# EAGLE schematic pdp8i (EAGLE 6.6.0), part 2 of 4
## Sheet 10 of 40
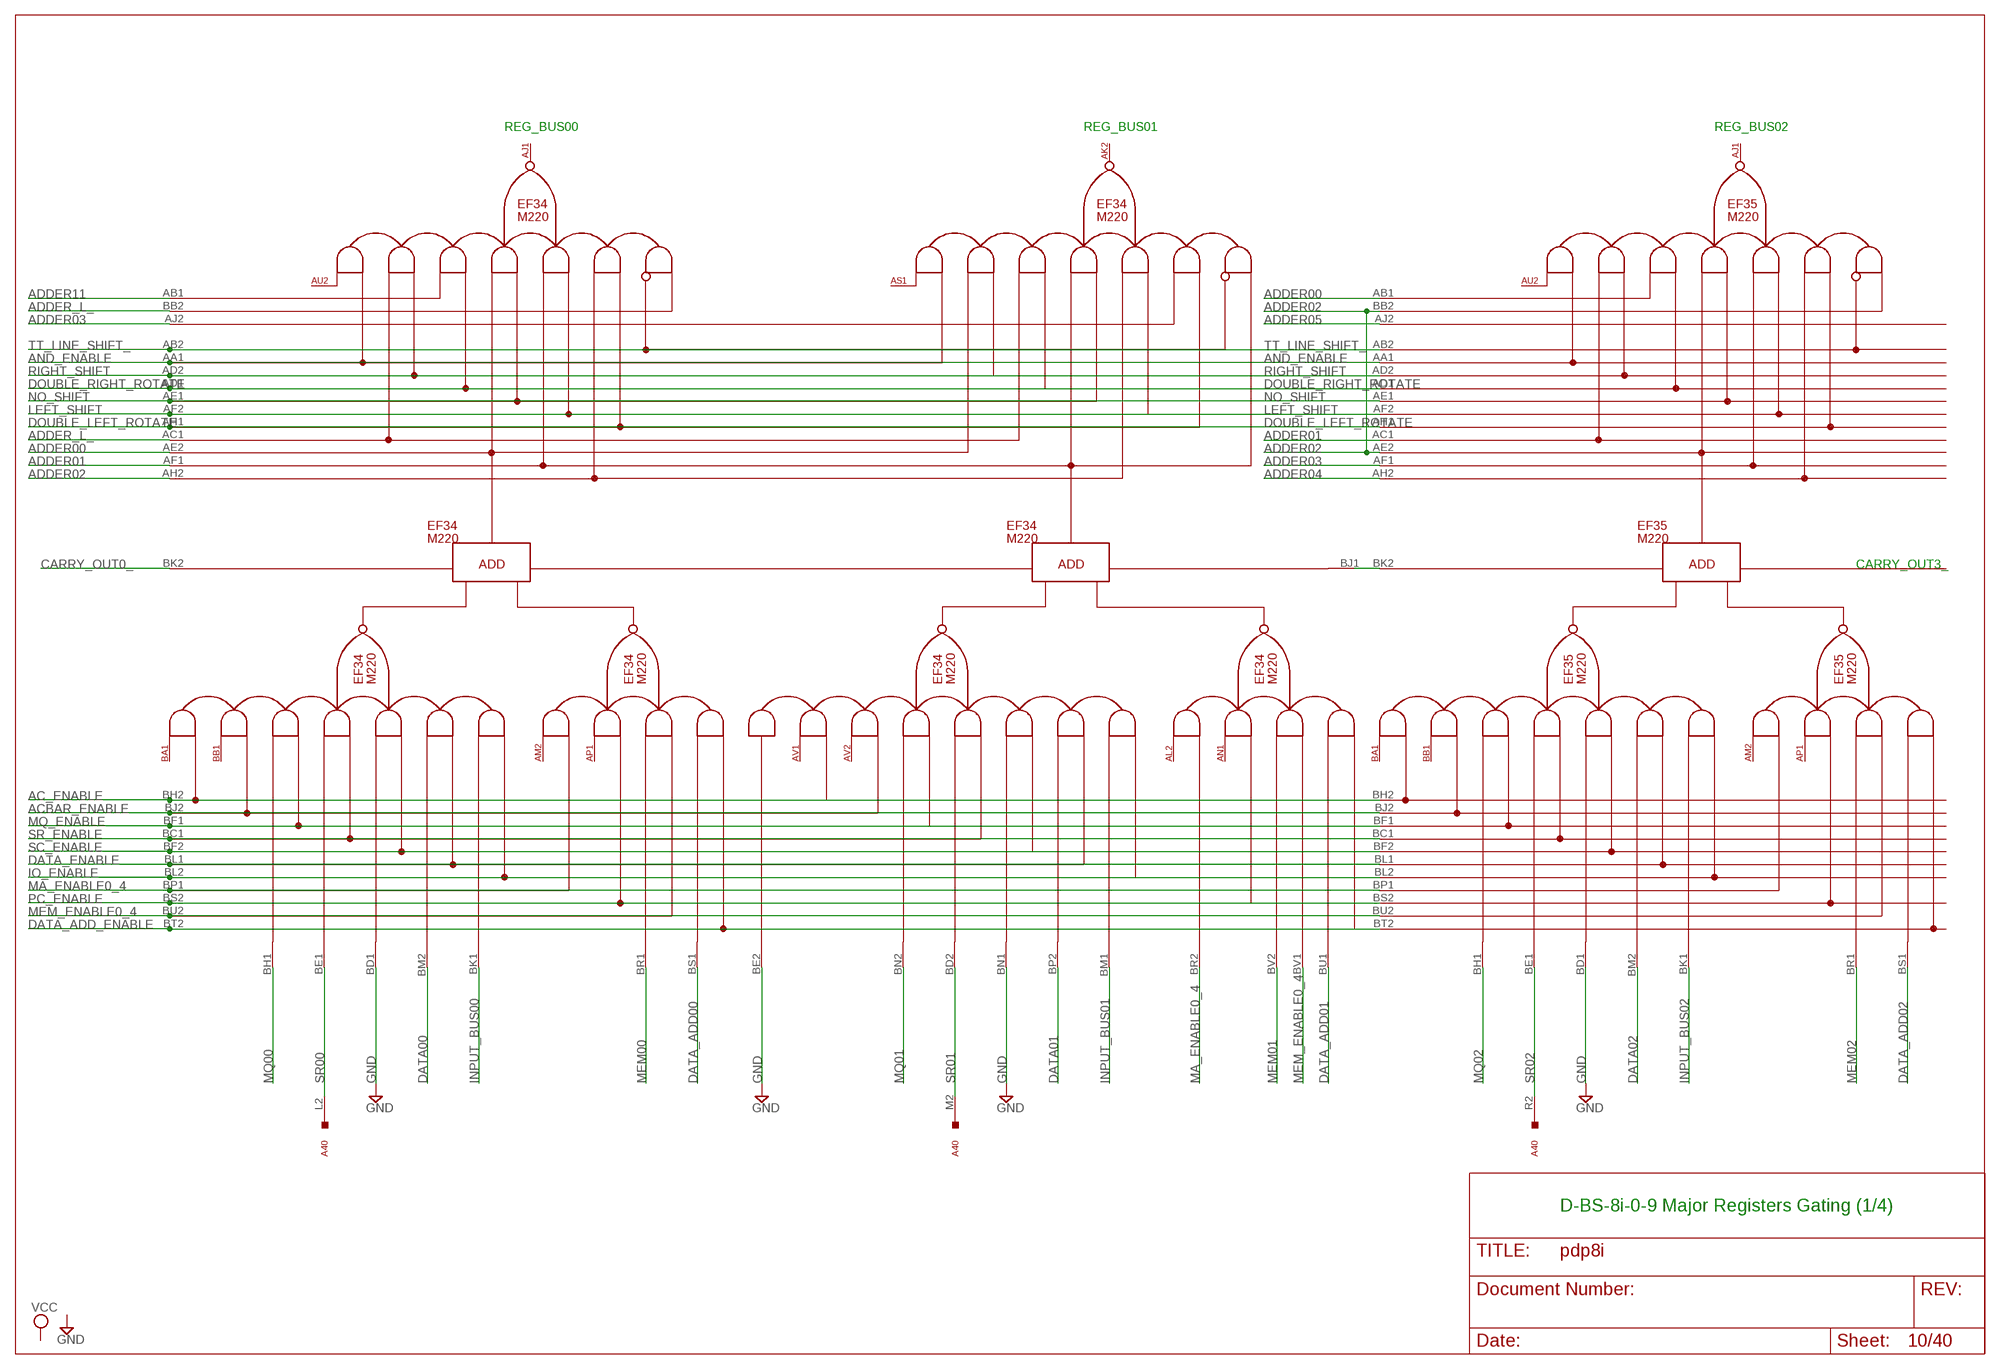
[diagram p9: schematic, sheet 10]

### Parts
A40  W077  M916  [H807]

### Nets
AC_ENABLE: EF34.BH2(B0:BH2) EF35.BH2(B0:BH2) ; also sheet 5,11,12,13
ACBAR_ENABLE: EF34.BJ2(B0:BJ2) EF35.BJ2(B0:BJ2) ; also sheet 5,11,12,13
ADDER00: EF34.AE2(B0:AE2) EF35.AB1(B0:AB1) ; also sheet 9,13
ADDER01: EF34.AF1(B0:AF1) EF35.AC1(B0:AC1) ; also sheet 9
ADDER02: EF34.AH2(B0:AH2) EF35.AE2(B0:AE2) EF35.BB2(B0:BB2) ; also sheet 11
ADDER03: EF34.AJ2(B0:AJ2) EF35.AF1(B0:AF1) ; also sheet 11
ADDER04: EF35.AH2(B0:AH2) ; also sheet 11,12
ADDER05: EF35.AJ2(B0:AJ2) ; also sheet 11,12
ADDER11: EF34.AB1(B0:AB1) ; also sheet 9,12,13
ADDER_L_: EF34.AC1(B0:AC1) EF34.BB2(B0:BB2) ; also sheet 9,13,28
AND_ENABLE: EF34.AA1(B0:AA1) EF35.AA1(B0:AA1) ; also sheet 6,11,12,13
CARRY_OUT0_: EF34.BK2(B0:BK2) ; also sheet 9
DATA00: EF34.BM2(B0:BM2) ; also sheet 14
DATA01: EF34.BP2(B1:BP2) ; also sheet 14
DATA02: EF35.BM2(B0:BM2) ; also sheet 14
DATA_ADD00: EF34.BS1(B0:BS1) ; also sheet 14
DATA_ADD01: EF34.BU1(B1:BU1) ; also sheet 14
DATA_ADD02: EF35.BS1(B0:BS1) ; also sheet 14
DATA_ADD_ENABLE: EF34.BT2(B0:BT2) EF35.BT2(B0:BT2) ; also sheet 5,11,12,13
DATA_ENABLE: EF34.BL1(B0:BL1) EF35.BL1(B0:BL1) ; also sheet 5,11,12,13
DOUBLE_LEFT_ROTATE: EF34.AH1(B0:AH1) EF35.AH1(B0:AH1) ; also sheet 6,9,11,12,13
DOUBLE_RIGHT_ROTATE: EF34.AD1(B0:AD1) EF35.AD1(B0:AD1) ; also sheet 6,9,11,12,13
GND [Suppply]: EF34.BD1(B0:BD1) EF34.BE2(B1:BE2) EF34.BN1(B1:BN1) EF35.BD1(B0:BD1) ; also sheet 2,5,9,11,12,13,14,15,17,18,23,26,27,30,33,34,35,39
INPUT_BUS00: EF34.BK1(B0:BK1) ; also sheet 14
INPUT_BUS01: EF34.BM1(B1:BM1) ; also sheet 14
INPUT_BUS02: EF35.BK1(B0:BK1) ; also sheet 14
IO_ENABLE: EF34.BL2(B0:BL2) EF35.BL2(B0:BL2) ; also sheet 5,7,11,12,13
LEFT_SHIFT: EF34.AF2(B0:AF2) EF35.AF2(B0:AF2) ; also sheet 6,9,11,12,13
MA_ENABLE0_4: EF34.BP1(B0:BP1) EF34.BR2(B1:BR2) EF35.BP1(B0:BP1) ; also sheet 5,11
MEM00: EF34.BR1(B0:BR1) ; also sheet 4,18,29,31
MEM01: EF34.BV2(B1:BV2) ; also sheet 4,18,31
MEM02: EF35.BR1(B0:BR1) ; also sheet 4,18,31
MEM_ENABLE0_4: EF34.BU2(B0:BU2) EF34.BV1(B1:BV1) EF35.BU2(B0:BU2) ; also sheet 5,6,11
MQ00: EF34.BH1(B0:BH1) ; also sheet 27,28
MQ01: EF34.BN2(B1:BN2) ; also sheet 28
MQ02: EF35.BH1(B0:BH1) ; also sheet 28
MQ_ENABLE: EF34.BF1(B0:BF1) EF35.BF1(B0:BF1) ; also sheet 11,12,13,27
N$160: EF34.BJ1(B1:BJ1) EF35.BK2(B0:BK2)
NO_SHIFT: EF34.AE1(B0:AE1) EF35.AE1(B0:AE1) ; also sheet 6,9,11,12,13
PC_ENABLE: EF34.BS2(B0:BS2) EF35.BS2(B0:BS2) ; also sheet 5,11,12,13
RIGHT_SHIFT: EF34.AD2(B0:AD2) EF35.AD2(B0:AD2) ; also sheet 6,9,11,12,13,28
SC_ENABLE: EF34.BF2(B0:BF2) EF35.BF2(B0:BF2) ; also sheet 11,12,13,27
SR00: A40.L2 EF34.BE1(B0:BE1)
SR01: A40.M2 EF34.BD2(B1:BD2)
SR02: A40.R2 EF35.BE1(B0:BE1)
SR_ENABLE: EF34.BC1(B0:BC1) EF35.BC1(B0:BC1) ; also sheet 5,11,12,13,22
TT_LINE_SHIFT_: EF34.AB2(B0:AB2) EF35.AB2(B0:AB2) ; also sheet 11,12,13,29
Unconnected: A40.A1 A40.B1 A40.B2 A40.C1 A40.D1 A40.E1 A40.F1 A40.H1 A40.J1 A40.K1 A40.L1 A40.M1 A40.N1 A40.N2 A40.P1 A40.P2 A40.R1 A40.S1 A40.T1 A40.U1 A40.V1

### Notes on the sheet
- REG_BUS00 | REG_BUS01 | REG_BUS02
- CARRY_OUT3_
- D-BS-8i-0-9 Major Registers Gating (1/4)

## Sheet 11 of 40
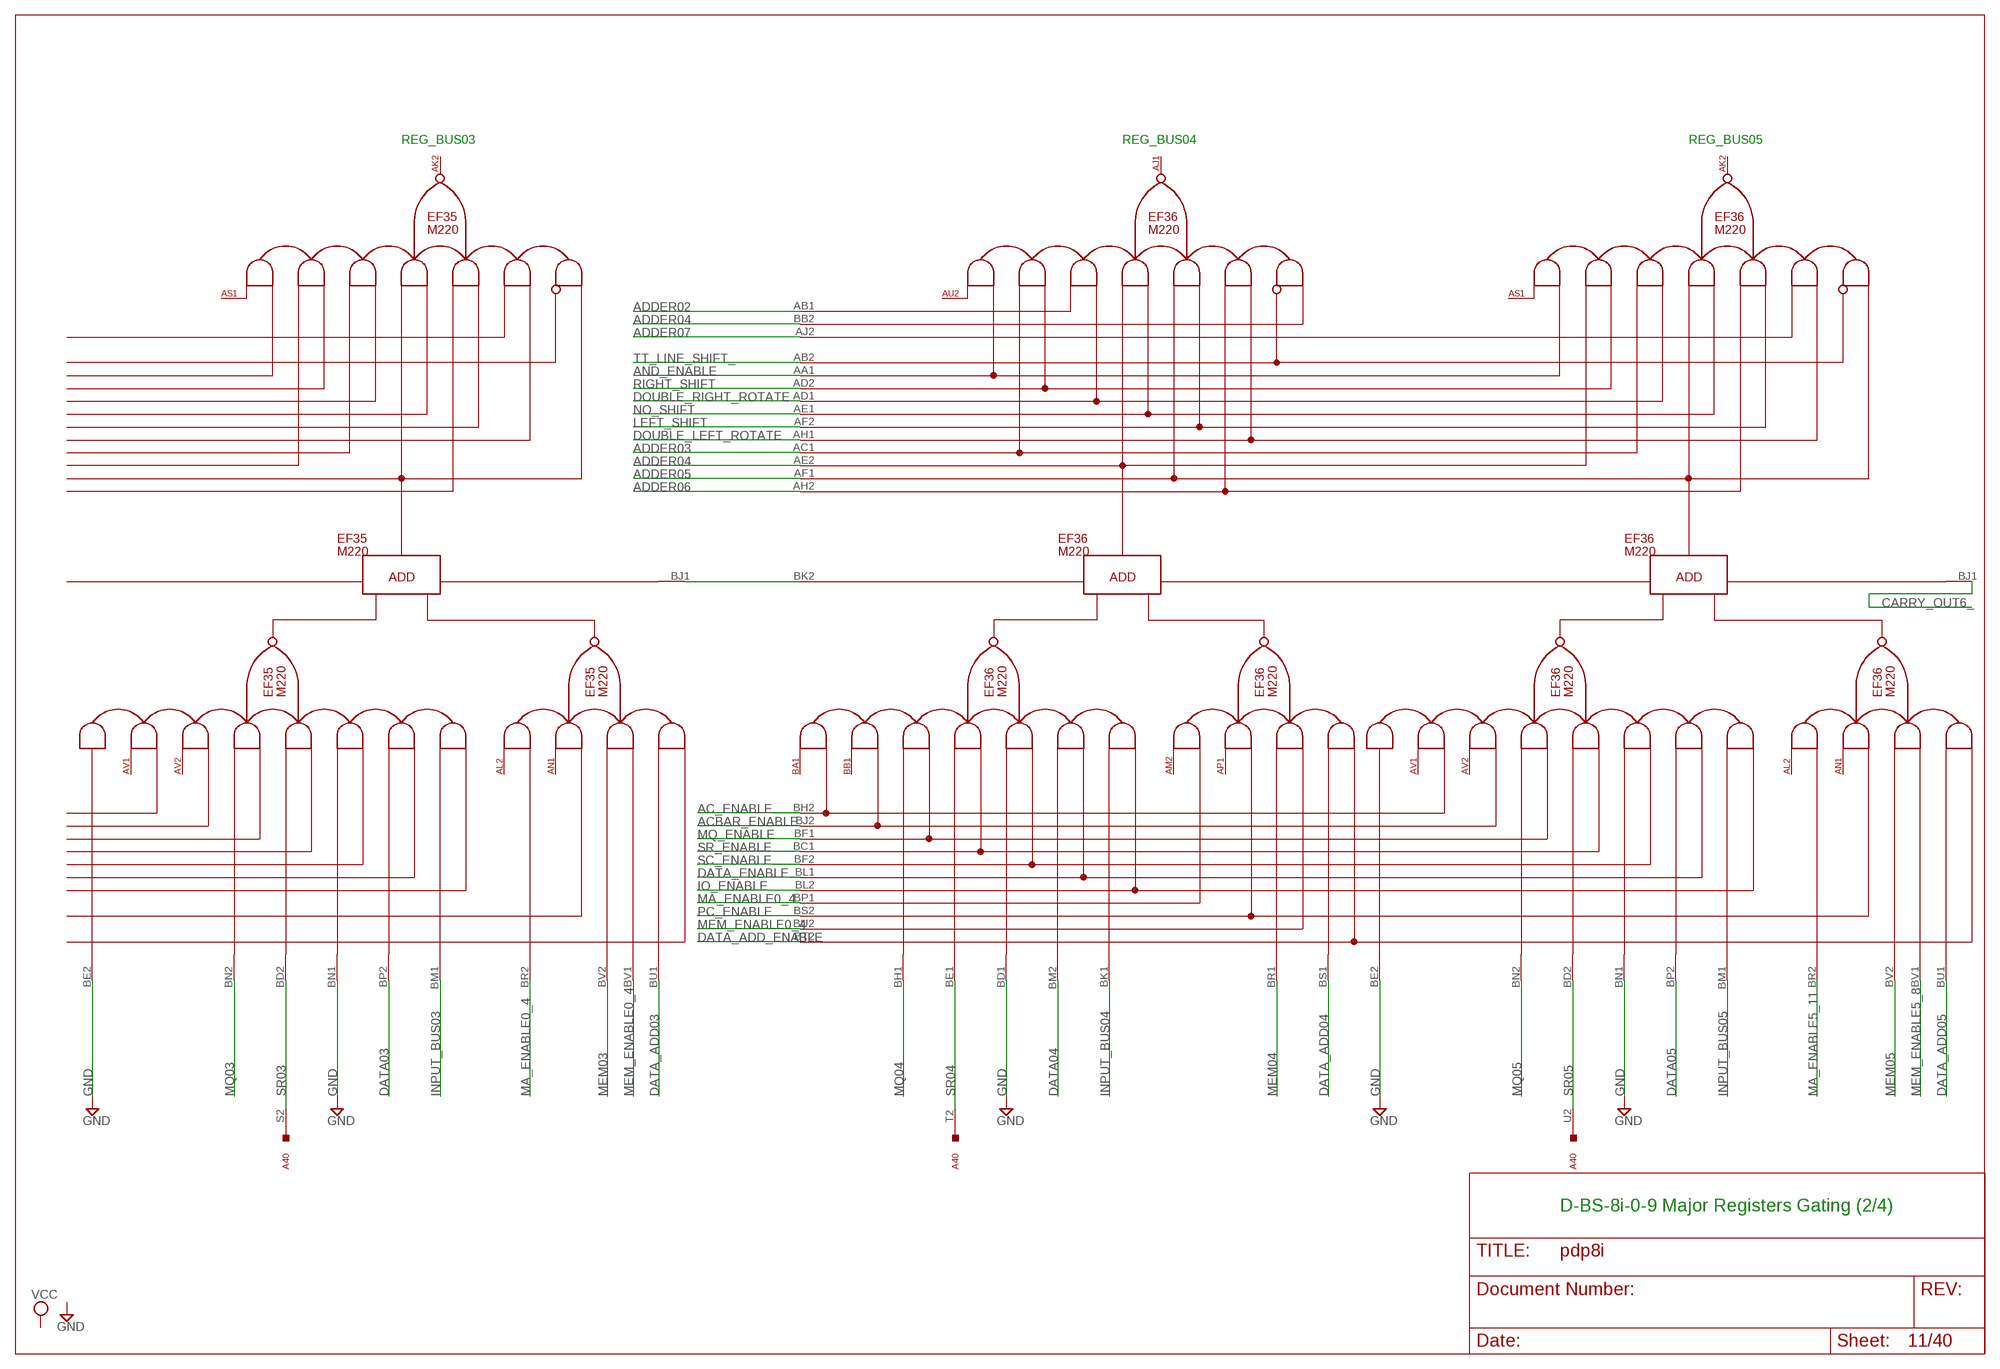
[diagram p10: schematic, sheet 11]

### Nets
AC_ENABLE: EF36.BH2(B0:BH2) ; also sheet 5,10,12,13
ACBAR_ENABLE: EF36.BJ2(B0:BJ2) ; also sheet 5,10,12,13
ADDER02: EF36.AB1(B0:AB1) ; also sheet 10
ADDER03: EF36.AC1(B0:AC1) ; also sheet 10
ADDER04: EF36.AE2(B0:AE2) EF36.BB2(B0:BB2) ; also sheet 10,12
ADDER05: EF36.AF1(B0:AF1) ; also sheet 10,12
ADDER06: EF36.AH2(B0:AH2) ; also sheet 12
ADDER07: EF36.AJ2(B0:AJ2) ; also sheet 12
AND_ENABLE: EF36.AA1(B0:AA1) ; also sheet 6,10,12,13
CARRY_OUT6_: EF36.BJ1(B1:BJ1) ; also sheet 12
DATA03: EF35.BP2(B1:BP2) ; also sheet 14
DATA04: EF36.BM2(B0:BM2) ; also sheet 14
DATA05: EF36.BP2(B1:BP2) ; also sheet 14
DATA_ADD03: EF35.BU1(B1:BU1) ; also sheet 14
DATA_ADD04: EF36.BS1(B0:BS1) ; also sheet 14
DATA_ADD05: EF36.BU1(B1:BU1) ; also sheet 14
DATA_ADD_ENABLE: EF36.BT2(B0:BT2) ; also sheet 5,10,12,13
DATA_ENABLE: EF36.BL1(B0:BL1) ; also sheet 5,10,12,13
DOUBLE_LEFT_ROTATE: EF36.AH1(B0:AH1) ; also sheet 6,9,10,12,13
DOUBLE_RIGHT_ROTATE: EF36.AD1(B0:AD1) ; also sheet 6,9,10,12,13
GND [Suppply]: EF35.BE2(B1:BE2) EF35.BN1(B1:BN1) EF36.BD1(B0:BD1) EF36.BE2(B1:BE2) EF36.BN1(B1:BN1) ; also sheet 2,5,9,10,12,13,14,15,17,18,23,26,27,30,33,34,35,39
INPUT_BUS03: EF35.BM1(B1:BM1) ; also sheet 14
INPUT_BUS04: EF36.BK1(B0:BK1) ; also sheet 14
INPUT_BUS05: EF36.BM1(B1:BM1) ; also sheet 14
IO_ENABLE: EF36.BL2(B0:BL2) ; also sheet 5,7,10,12,13
LEFT_SHIFT: EF36.AF2(B0:AF2) ; also sheet 6,9,10,12,13
MA_ENABLE0_4: EF35.BR2(B1:BR2) EF36.BP1(B0:BP1) ; also sheet 5,10
MA_ENABLE5_11: EF36.BR2(B1:BR2) ; also sheet 5,12,13
MEM03: EF35.BV2(B1:BV2) ; also sheet 18,31
MEM04: EF36.BR1(B0:BR1) ; also sheet 18,31
MEM05: EF36.BV2(B1:BV2) ; also sheet 18,31
MEM_ENABLE0_4: EF35.BV1(B1:BV1) EF36.BU2(B0:BU2) ; also sheet 5,6,10
MEM_ENABLE5_8: EF36.BV1(B1:BV1) ; also sheet 5,12
MQ03: EF35.BN2(B1:BN2) ; also sheet 28
MQ04: EF36.BH1(B0:BH1) ; also sheet 28
MQ05: EF36.BN2(B1:BN2) ; also sheet 28
MQ_ENABLE: EF36.BF1(B0:BF1) ; also sheet 10,12,13,27
N$133: EF35.BJ1(B1:BJ1) EF36.BK2(B0:BK2)
NO_SHIFT: EF36.AE1(B0:AE1) ; also sheet 6,9,10,12,13
PC_ENABLE: EF36.BS2(B0:BS2) ; also sheet 5,10,12,13
RIGHT_SHIFT: EF36.AD2(B0:AD2) ; also sheet 6,9,10,12,13,28
SC_ENABLE: EF36.BF2(B0:BF2) ; also sheet 10,12,13,27
SR03: A40.S2 EF35.BD2(B1:BD2)
SR04: A40.T2 EF36.BE1(B0:BE1)
SR05: A40.U2 EF36.BD2(B1:BD2)
SR_ENABLE: EF36.BC1(B0:BC1) ; also sheet 5,10,12,13,22
TT_LINE_SHIFT_: EF36.AB2(B0:AB2) ; also sheet 10,12,13,29

### Notes on the sheet
- REG_BUS03 | REG_BUS04 | REG_BUS05
- D-BS-8i-0-9 Major Registers Gating (2/4)

## Sheet 12 of 40
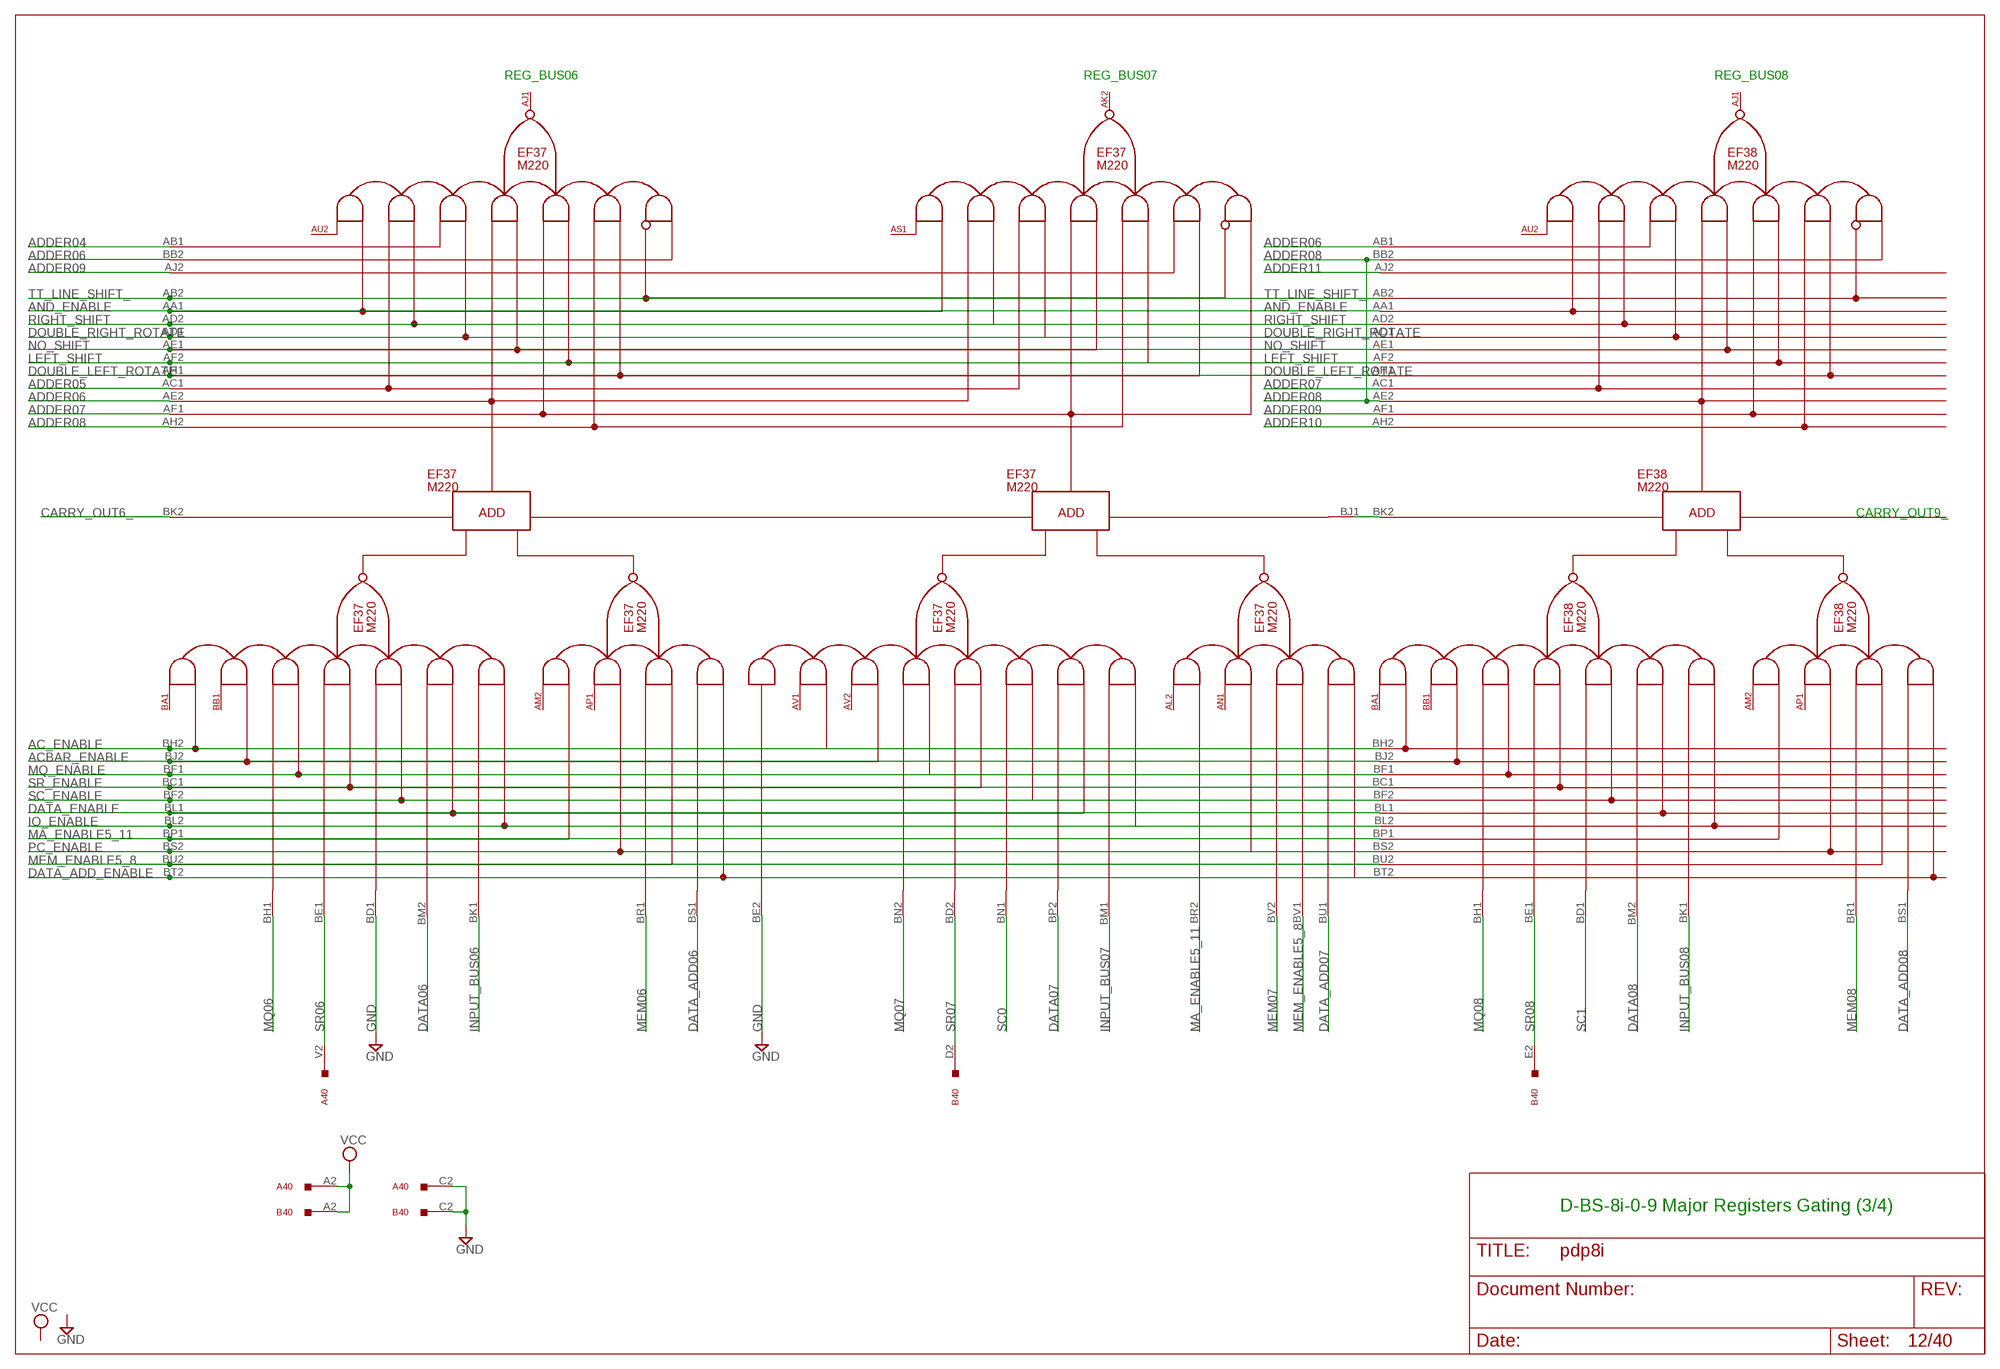
[diagram p11: schematic, sheet 12]

### Nets
AC_ENABLE: EF37.BH2(B0:BH2) EF38.BH2(B0:BH2) ; also sheet 5,10,11,13
ACBAR_ENABLE: EF37.BJ2(B0:BJ2) EF38.BJ2(B0:BJ2) ; also sheet 5,10,11,13
ADDER04: EF37.AB1(B0:AB1) ; also sheet 10,11
ADDER05: EF37.AC1(B0:AC1) ; also sheet 10,11
ADDER06: EF37.AE2(B0:AE2) EF37.BB2(B0:BB2) EF38.AB1(B0:AB1) ; also sheet 11
ADDER07: EF37.AF1(B0:AF1) EF38.AC1(B0:AC1) ; also sheet 11
ADDER08: EF37.AH2(B0:AH2) EF38.AE2(B0:AE2) EF38.BB2(B0:BB2) ; also sheet 13
ADDER09: EF37.AJ2(B0:AJ2) EF38.AF1(B0:AF1) ; also sheet 13
ADDER10: EF38.AH2(B0:AH2) ; also sheet 9,13
ADDER11: EF38.AJ2(B0:AJ2) ; also sheet 9,10,13
AND_ENABLE: EF37.AA1(B0:AA1) EF38.AA1(B0:AA1) ; also sheet 6,10,11,13
CARRY_OUT6_: EF37.BK2(B0:BK2) ; also sheet 11
DATA06: EF37.BM2(B0:BM2) ; also sheet 14
DATA07: EF37.BP2(B1:BP2) ; also sheet 14
DATA08: EF38.BM2(B0:BM2) ; also sheet 14
DATA_ADD06: EF37.BS1(B0:BS1) ; also sheet 14
DATA_ADD07: EF37.BU1(B1:BU1) ; also sheet 14
DATA_ADD08: EF38.BS1(B0:BS1) ; also sheet 14
DATA_ADD_ENABLE: EF37.BT2(B0:BT2) EF38.BT2(B0:BT2) ; also sheet 5,10,11,13
DATA_ENABLE: EF37.BL1(B0:BL1) EF38.BL1(B0:BL1) ; also sheet 5,10,11,13
DOUBLE_LEFT_ROTATE: EF37.AH1(B0:AH1) EF38.AH1(B0:AH1) ; also sheet 6,9,10,11,13
DOUBLE_RIGHT_ROTATE: EF37.AD1(B0:AD1) EF38.AD1(B0:AD1) ; also sheet 6,9,10,11,13
GND [Suppply]: A40.C2 B40.C2 EF37.BD1(B0:BD1) EF37.BE2(B1:BE2) ; also sheet 2,5,9,10,11,13,14,15,17,18,23,26,27,30,33,34,35,39
INPUT_BUS06: EF37.BK1(B0:BK1) ; also sheet 14
INPUT_BUS07: EF37.BM1(B1:BM1) ; also sheet 14
INPUT_BUS08: EF38.BK1(B0:BK1) ; also sheet 14
IO_ENABLE: EF37.BL2(B0:BL2) EF38.BL2(B0:BL2) ; also sheet 5,7,10,11,13
LEFT_SHIFT: EF37.AF2(B0:AF2) EF38.AF2(B0:AF2) ; also sheet 6,9,10,11,13
MA_ENABLE5_11: EF37.BP1(B0:BP1) EF37.BR2(B1:BR2) EF38.BP1(B0:BP1) ; also sheet 5,11,13
MEM06: EF37.BR1(B0:BR1) ; also sheet 18,31
MEM07: EF37.BV2(B1:BV2) ; also sheet 18,31
MEM08: EF38.BR1(B0:BR1) ; also sheet 18,31
MEM_ENABLE5_8: EF37.BU2(B0:BU2) EF37.BV1(B1:BV1) EF38.BU2(B0:BU2) ; also sheet 5,11
MQ06: EF37.BH1(B0:BH1) ; also sheet 28
MQ07: EF37.BN2(B1:BN2) ; also sheet 28
MQ08: EF38.BH1(B0:BH1) ; also sheet 28
MQ_ENABLE: EF37.BF1(B0:BF1) EF38.BF1(B0:BF1) ; also sheet 10,11,13,27
N$132: EF37.BJ1(B1:BJ1) EF38.BK2(B0:BK2)
NO_SHIFT: EF37.AE1(B0:AE1) EF38.AE1(B0:AE1) ; also sheet 6,9,10,11,13
PC_ENABLE: EF37.BS2(B0:BS2) EF38.BS2(B0:BS2) ; also sheet 5,10,11,13
RIGHT_SHIFT: EF37.AD2(B0:AD2) EF38.AD2(B0:AD2) ; also sheet 6,9,10,11,13,28
SC0: EF37.BN1(B1:BN1) ; also sheet 27,28
SC1: EF38.BD1(B0:BD1) ; also sheet 27,28
SC_ENABLE: EF37.BF2(B0:BF2) EF38.BF2(B0:BF2) ; also sheet 10,11,13,27
SR06: A40.V2 EF37.BE1(B0:BE1)
SR07: B40.D2 EF37.BD2(B1:BD2)
SR08: B40.E2 EF38.BE1(B0:BE1)
SR_ENABLE: EF37.BC1(B0:BC1) EF38.BC1(B0:BC1) ; also sheet 5,10,11,13,22
TT_LINE_SHIFT_: EF37.AB2(B0:AB2) EF38.AB2(B0:AB2) ; also sheet 10,11,13,29
VCC [Suppply]: A40.A2 B40.A2 ; also sheet 9,33

### Notes on the sheet
- REG_BUS06 | REG_BUS07 | REG_BUS08
- CARRY_OUT9_
- D-BS-8i-0-9 Major Registers Gating (3/4)

## Sheet 13 of 40
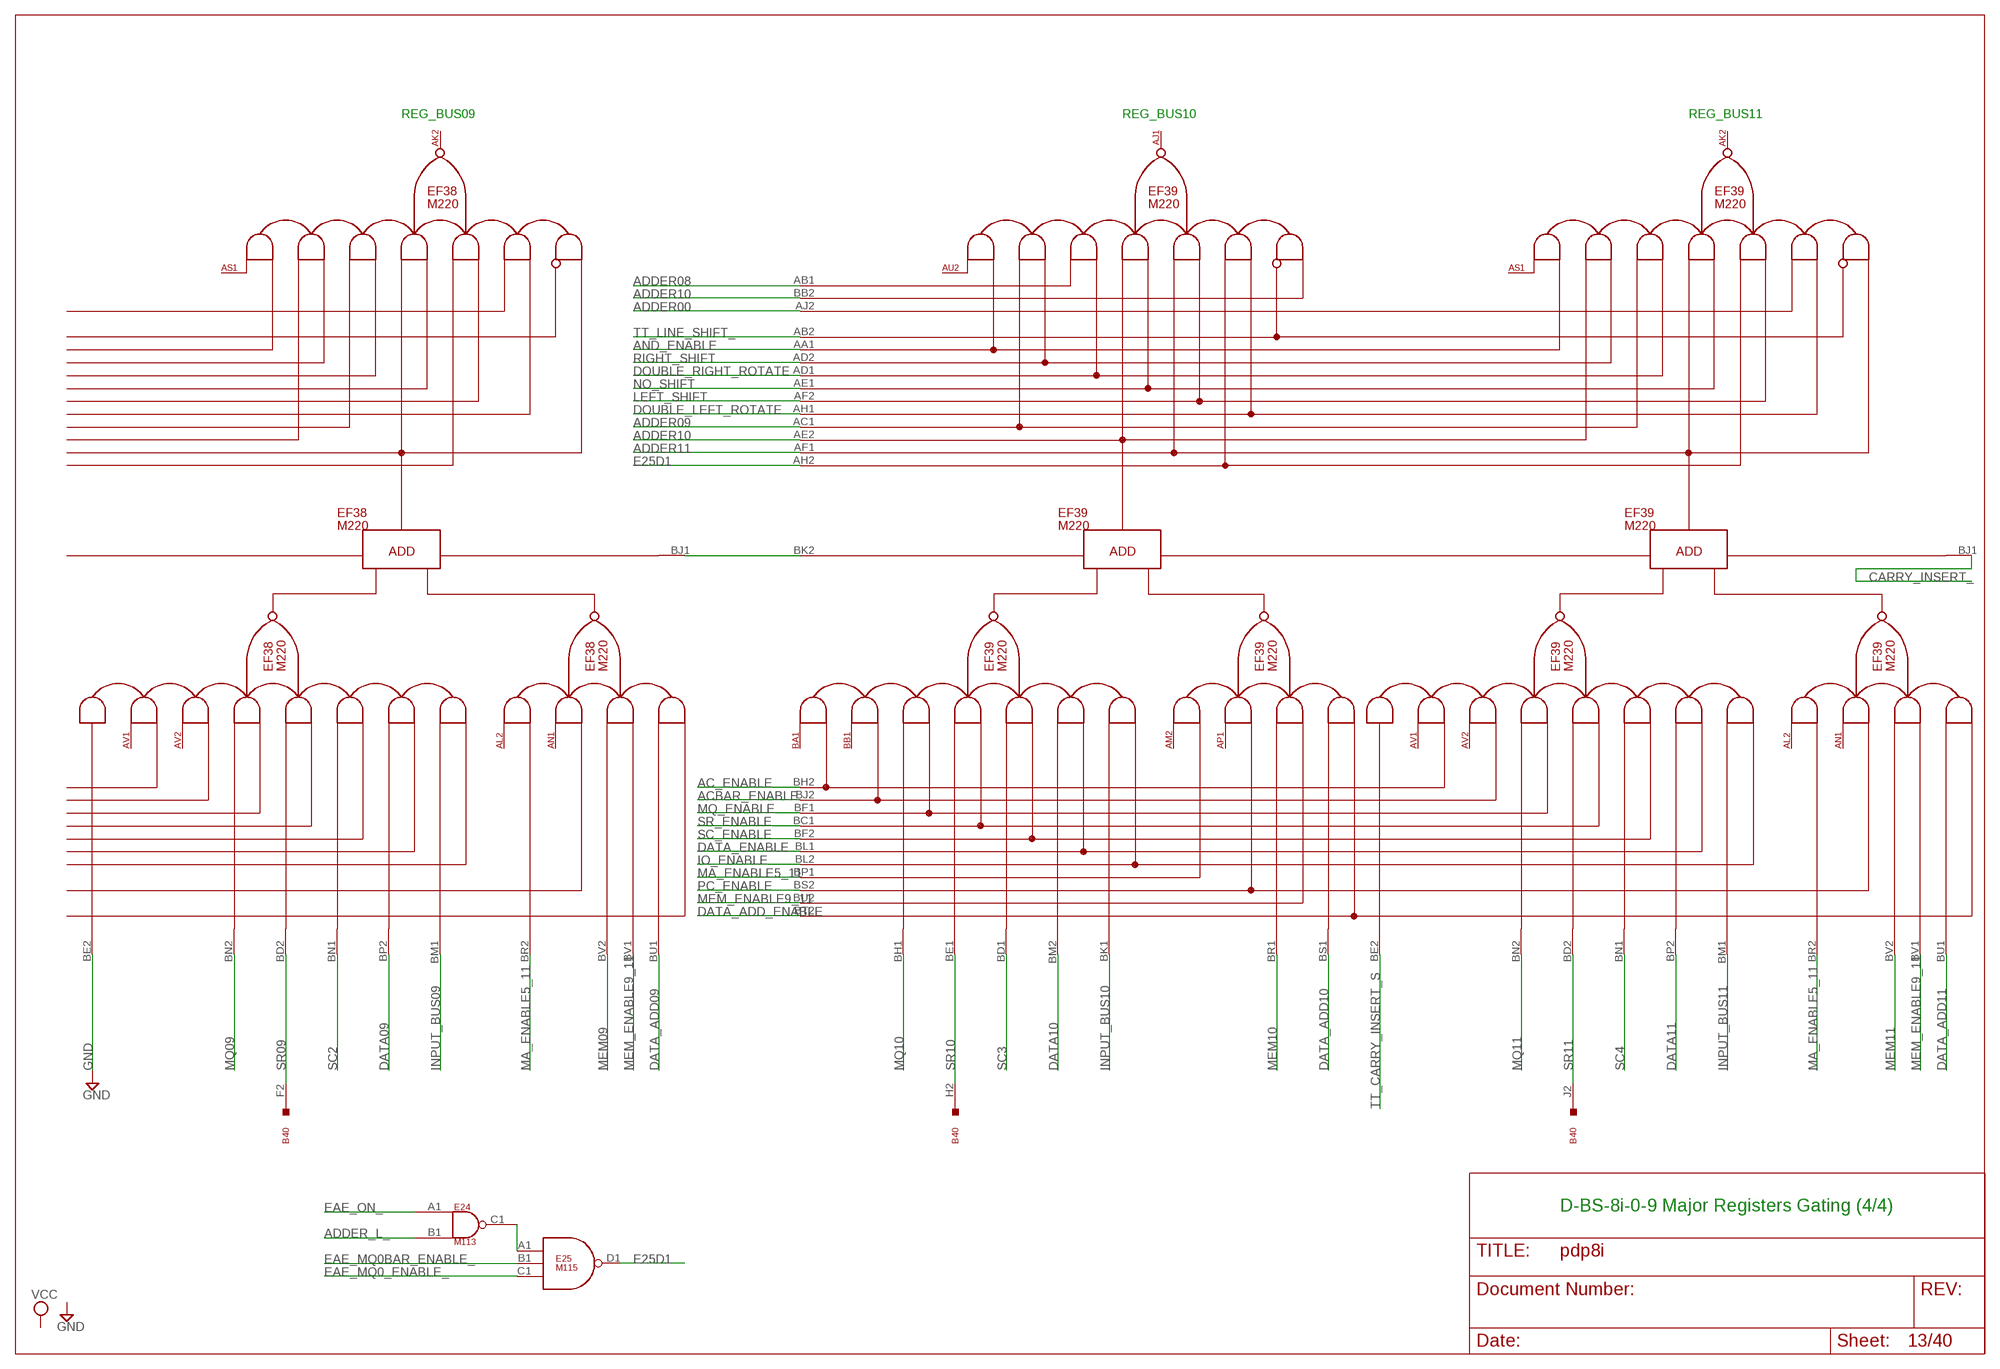
[diagram p12: schematic, sheet 13]

### Nets
AC_ENABLE: EF39.BH2(B0:BH2) ; also sheet 5,10,11,12
ACBAR_ENABLE: EF39.BJ2(B0:BJ2) ; also sheet 5,10,11,12
ADDER00: EF39.AJ2(B0:AJ2) ; also sheet 9,10
ADDER08: EF39.AB1(B0:AB1) ; also sheet 12
ADDER09: EF39.AC1(B0:AC1) ; also sheet 12
ADDER10: EF39.AE2(B0:AE2) EF39.BB2(B0:BB2) ; also sheet 9,12
ADDER11: EF39.AF1(B0:AF1) ; also sheet 9,10,12
ADDER_L_: E24.B1(C1:IN2) ; also sheet 9,10,28
AND_ENABLE: EF39.AA1(B0:AA1) ; also sheet 6,10,11,12
CARRY_INSERT_: EF39.BJ1(B1:BJ1) ; also sheet 6
DATA09: EF38.BP2(B1:BP2) ; also sheet 14
DATA10: EF39.BM2(B0:BM2) ; also sheet 14
DATA11: EF39.BP2(B1:BP2) ; also sheet 14
DATA_ADD09: EF38.BU1(B1:BU1) ; also sheet 14
DATA_ADD10: EF39.BS1(B0:BS1) ; also sheet 14
DATA_ADD11: EF39.BU1(B1:BU1) ; also sheet 14
DATA_ADD_ENABLE: EF39.BT2(B0:BT2) ; also sheet 5,10,11,12
DATA_ENABLE: EF39.BL1(B0:BL1) ; also sheet 5,10,11,12
DOUBLE_LEFT_ROTATE: EF39.AH1(B0:AH1) ; also sheet 6,9,10,11,12
DOUBLE_RIGHT_ROTATE: EF39.AD1(B0:AD1) ; also sheet 6,9,10,11,12
E25D1: E25.D1(D1:OUT) EF39.AH2(B0:AH2)
EAE_MQ0_ENABLE_: E25.C1(D1:IN3) ; also sheet 27
EAE_MQ0BAR_ENABLE_: E25.B1(D1:IN2) ; also sheet 27
EAE_ON_: E24.A1(C1:IN1) ; also sheet 9,27
GND [Suppply]: EF38.BE2(B1:BE2) ; also sheet 2,5,9,10,11,12,14,15,17,18,23,26,27,30,33,34,35,39
INPUT_BUS09: EF38.BM1(B1:BM1) ; also sheet 14
INPUT_BUS10: EF39.BK1(B0:BK1) ; also sheet 14
INPUT_BUS11: EF39.BM1(B1:BM1) ; also sheet 14
IO_ENABLE: EF39.BL2(B0:BL2) ; also sheet 5,7,10,11,12
LEFT_SHIFT: EF39.AF2(B0:AF2) ; also sheet 6,9,10,11,12
MA_ENABLE5_11: EF38.BR2(B1:BR2) EF39.BP1(B0:BP1) EF39.BR2(B1:BR2) ; also sheet 5,11,12
MEM09: EF38.BV2(B1:BV2) ; also sheet 18,29,31
MEM10: EF39.BR1(B0:BR1) ; also sheet 18,31
MEM11: EF39.BV2(B1:BV2) ; also sheet 18,31
MEM_ENABLE9_11: EF38.BV1(B1:BV1) EF39.BU2(B0:BU2) EF39.BV1(B1:BV1) ; also sheet 5
MQ09: EF38.BN2(B1:BN2) ; also sheet 28
MQ10: EF39.BH1(B0:BH1) ; also sheet 27,28
MQ11: EF39.BN2(B1:BN2) ; also sheet 27,28
MQ_ENABLE: EF39.BF1(B0:BF1) ; also sheet 10,11,12,27
N$136: EF38.BJ1(B1:BJ1) EF39.BK2(B0:BK2)
N$140: E24.C1(C1:OUT) E25.A1(D1:IN1)
NO_SHIFT: EF39.AE1(B0:AE1) ; also sheet 6,9,10,11,12
PC_ENABLE: EF39.BS2(B0:BS2) ; also sheet 5,10,11,12
RIGHT_SHIFT: EF39.AD2(B0:AD2) ; also sheet 6,9,10,11,12,28
SC2: EF38.BN1(B1:BN1) ; also sheet 27,28
SC3: EF39.BD1(B0:BD1) ; also sheet 27,28
SC4: EF39.BN1(B1:BN1) ; also sheet 27,28
SC_ENABLE: EF39.BF2(B0:BF2) ; also sheet 10,11,12,27
SR09: B40.F2 EF38.BD2(B1:BD2)
SR10: B40.H2 EF39.BE1(B0:BE1)
SR11: B40.J2 EF39.BD2(B1:BD2)
SR_ENABLE: EF39.BC1(B0:BC1) ; also sheet 5,10,11,12,22
TT_CARRY_INSERT_S: EF39.BE2(B1:BE2) ; also sheet 29
TT_LINE_SHIFT_: EF39.AB2(B0:AB2) ; also sheet 10,11,12,29

### Notes on the sheet
- REG_BUS09 | REG_BUS10 | REG_BUS11
- D-BS-8i-0-9 Major Registers Gating (4/4)

## Sheet 14 of 40
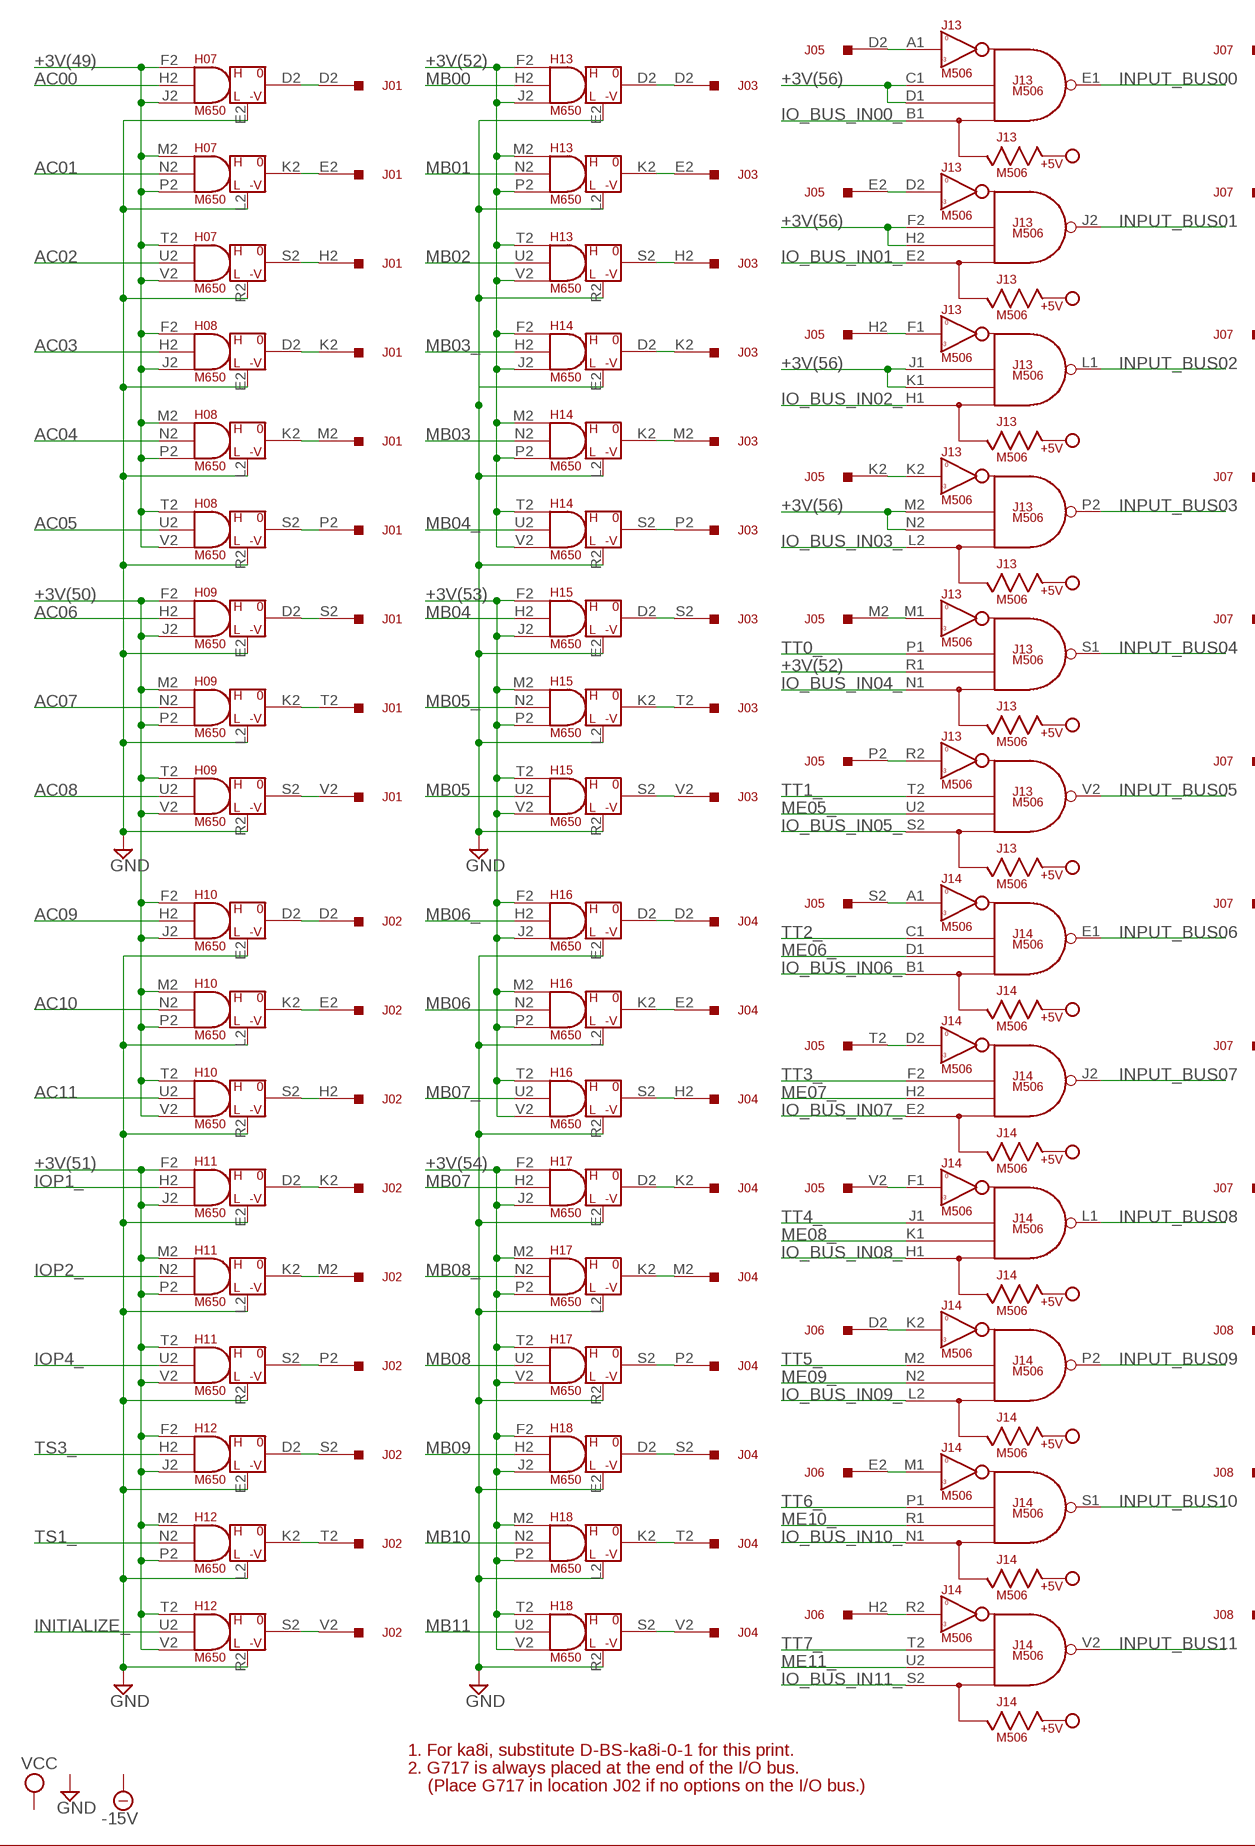
[diagram p13: schematic, sheet 14, part 1 of 2]
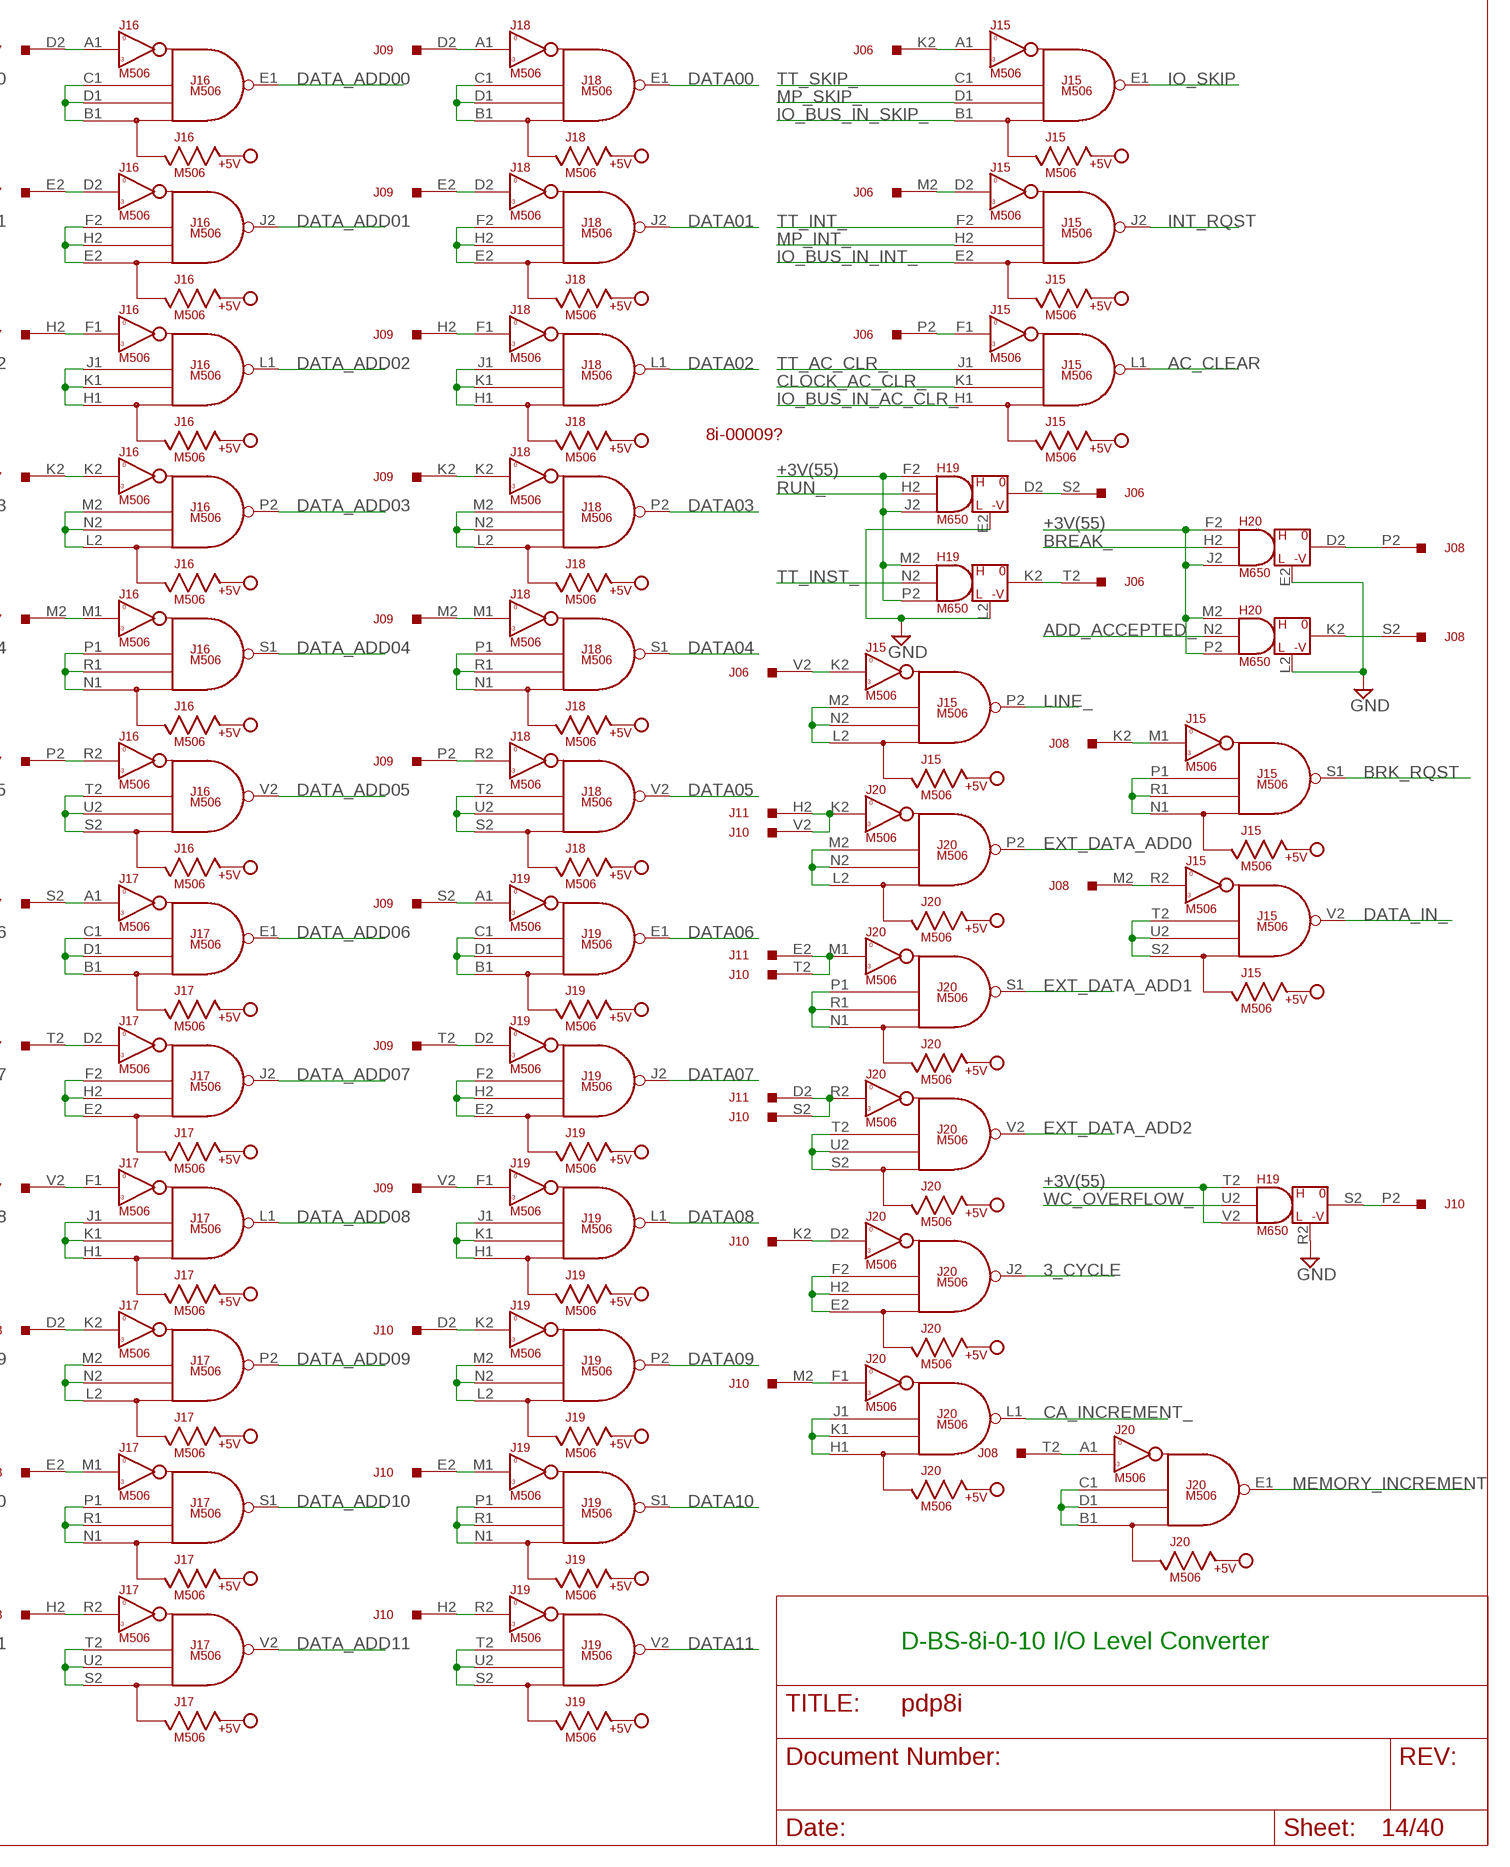
[diagram p14: schematic, sheet 14, part 2 of 2]

### Parts
H07  M650  [H807]
H08  M650  [H807]
H09  M650  [H807]
H10  M650  [H807]
H11  M650  [H807]
H12  M650  [H807]
H13  M650  [H807]
H14  M650  [H807]
H15  M650  [H807]
H16  M650  [H807]
H17  M650  [H807]
H18  M650  [H807]
H19  M650  [H807]
H20  M650  [H807]
J01  W011  [H807]
J02  W011  [H807]
J03  W011  [H807]
J04  W011  [H807]
J05  W011  [H807]
J06  W011  [H807]
J07  W011  [H807]
J08  W011  [H807]
J09  W011  [H807]
J10  W011  [H807]
J13  M506  [H807]
J14  M506  [H807]
J15  M506  [H807]
J16  M506  [H807]
J17  M506  [H807]
J18  M506  [H807]
J19  M506  [H807]
J20  M506  [H807]

### Nets
3_CYCLE: J20.J2(J2:OUT) ; also sheet 4
3CYCLE: J10.K2 J20.D2(J2:IN)
+3V(49): H07.F2(IN1) H07.J2(IN3) H07.M2(IN1) H07.P2(IN3) H07.T2(IN1) H07.V2(IN3) H08.F2(IN1) H08.J2(IN3) H08.M2(IN1) H08.P2(IN3) H08.T2(IN1) H08.V2(IN3) ; also sheet 1
+3V(50): H09.F2(IN1) H09.J2(IN3) H09.M2(IN1) H09.P2(IN3) H09.T2(IN1) H09.V2(IN3) H10.F2(IN1) H10.J2(IN3) H10.M2(IN1) H10.P2(IN3) H10.T2(IN1) H10.V2(IN3) ; also sheet 1
+3V(51): H11.F2(IN1) H11.J2(IN3) H11.M2(IN1) H11.P2(IN3) H11.T2(IN1) H11.V2(IN3) H12.F2(IN1) H12.J2(IN3) H12.M2(IN1) H12.P2(IN3) H12.T2(IN1) H12.V2(IN3) ; also sheet 1
+3V(52): H13.F2(IN1) H13.J2(IN3) H13.M2(IN1) H13.P2(IN3) H13.T2(IN1) H13.V2(IN3) H14.F2(IN1) H14.J2(IN3) H14.M2(IN1) H14.P2(IN3) H14.T2(IN1) H14.V2(IN3) J13.R1(S1:IN4) ; also sheet 1
+3V(53): H15.F2(IN1) H15.J2(IN3) H15.M2(IN1) H15.P2(IN3) H15.T2(IN1) H15.V2(IN3) H16.F2(IN1) H16.J2(IN3) H16.M2(IN1) H16.P2(IN3) H16.T2(IN1) H16.V2(IN3) ; also sheet 1
+3V(54): H17.F2(IN1) H17.J2(IN3) H17.M2(IN1) H17.P2(IN3) H17.T2(IN1) H17.V2(IN3) H18.F2(IN1) H18.J2(IN3) H18.M2(IN1) H18.P2(IN3) H18.T2(IN1) H18.V2(IN3) ; also sheet 1
+3V(55): H19.F2(IN1) H19.J2(IN3) H19.M2(IN1) H19.P2(IN3) H19.T2(IN1) H19.V2(IN3) H20.F2(IN1) H20.J2(IN3) H20.M2(IN1) H20.P2(IN3) ; also sheet 1,4
+3V(56): J13.C1(E1:IN3) J13.D1(E1:IN4) J13.F2(J2:IN3) J13.H2(J2:IN4) J13.J1(L1:IN3) J13.K1(L1:IN4) J13.M2(P2:IN3) J13.N2(P2:IN4) ; also sheet 1
AC00: H07.H2(IN2) ; also sheet 7,9,27,28,37
AC01: H07.N2(IN2) ; also sheet 9,27,28,37
AC02: H07.U2(IN2) ; also sheet 9,27,28,33,37
AC03: H08.H2(IN2) ; also sheet 9,28,33,37
AC04: H08.N2(IN2) ; also sheet 9,16,28,33,35,37
AC05: H08.U2(IN2) ; also sheet 9,16,28,33,35,37
AC06: H09.H2(IN2) ; also sheet 9,16,28,33,35,37
AC07: H09.N2(IN2) ; also sheet 9,16,28,33,35,37
AC08: H09.U2(IN2) ; also sheet 9,16,28,33,35,37
AC09: H10.H2(IN2) ; also sheet 9,16,28,33,35,37
AC10: H10.N2(IN2) ; also sheet 9,16,28,33,35,37
AC11: H10.U2(IN2) ; also sheet 9,16,28,33,35,37
AC_CLEAR: J15.L1(L1:OUT) ; also sheet 5
ACCLR: J06.P2 J15.F1(L1:IN)
ADD_ACCEPTED_: H20.N2(IN2) ; also sheet 8
BAC00: H07.D2(OUT) J01.D2
BAC01: H07.K2(OUT) J01.E2
BAC02: H07.S2(OUT) J01.H2
BAC03: H08.D2(OUT) J01.K2
BAC04: H08.K2(OUT) J01.M2
BAC05: H08.S2(OUT) J01.P2
BAC06: H09.D2(OUT) J01.S2
BAC07: H09.K2(OUT) J01.T2
BAC08: H09.S2(OUT) J01.V2
BAC09: H10.D2(OUT) J02.D2
BAC10: H10.K2(OUT) J02.E2
BAC11: H10.S2(OUT) J02.H2
BADD_ACCEPTED_: H20.K2(OUT) J08.S2
BBREAK: H20.D2(OUT) J08.P2
BINITIALIZE_: H12.S2(OUT) J02.V2
BIOP1_: H11.D2(OUT) J02.K2
BIOP2_: H11.K2(OUT) J02.M2
BIOP4_: H11.S2(OUT) J02.P2
BMB00: H13.D2(OUT) J03.D2
BMB01: H13.K2(OUT) J03.E2
BMB02: H13.S2(OUT) J03.H2
BMB03: H14.K2(OUT) J03.M2
BMB03_: H14.D2(OUT) J03.K2
BMB04: H15.D2(OUT) J03.S2
BMB04_: H14.S2(OUT) J03.P2
BMB05: H15.S2(OUT) J03.V2
BMB05_: H15.K2(OUT) J03.T2
BMB06: H16.K2(OUT) J04.E2
BMB06_: H16.D2(OUT) J04.D2
BMB07: H17.D2(OUT) J04.K2
BMB07_: H16.S2(OUT) J04.H2
BMB08: H17.S2(OUT) J04.P2
BMB08_: H17.K2(OUT) J04.M2
BMB09: H18.D2(OUT) J04.S2
BMB10: H18.K2(OUT) J04.T2
BMB11: H18.S2(OUT) J04.V2
BREAK_: H20.H2(IN2) ; also sheet 4
BRK_RQST: J15.S1(S1:OUT) ; also sheet 4
BRQ: J08.K2 J15.M1(S1:IN)
BRUN_: H19.D2(OUT) J06.S2
BTS1: H12.K2(OUT) J02.T2
BTS3: H12.D2(OUT) J02.S2
BTT_INST_: H19.K2(OUT) J06.T2
BWC_OVERFLOW: H19.S2(OUT) J10.P2
CA_INCR_: J10.M2 J20.F1(L1:IN)
CA_INCREMENT_: J20.L1(L1:OUT) ; also sheet 6
CLOCK_AC_CLR_: J15.K1(L1:IN4) ; also sheet 37
D00: J09.D2 J18.A1(E1:IN)
D01: J09.E2 J18.D2(J2:IN)
D02: J09.H2 J18.F1(L1:IN)
D03: J09.K2 J18.K2(P2:IN)
D04: J09.M2 J18.M1(S1:IN)
D05: J09.P2 J18.R2(V2:IN)
D06: J09.S2 J19.A1(E1:IN)
D07: J09.T2 J19.D2(J2:IN)
D08: J09.V2 J19.F1(L1:IN)
D09: J10.D2 J19.K2(P2:IN)
D10: J10.E2 J19.M1(S1:IN)
D11: J10.H2 J19.R2(V2:IN)
D_IN_: J08.M2 J15.R2(V2:IN)
DA00: J07.D2 J16.A1(E1:IN)
DA01: J07.E2 J16.D2(J2:IN)
DA02: J07.H2 J16.F1(L1:IN)
DA03: J07.K2 J16.K2(P2:IN)
DA04: J07.M2 J16.M1(S1:IN)
DA05: J07.P2 J16.R2(V2:IN)
DA06: J07.S2 J17.A1(E1:IN)
DA07: J07.T2 J17.D2(J2:IN)
DA08: J07.V2 J17.F1(L1:IN)
DA09: J08.D2 J17.K2(P2:IN)
DA10: J08.E2 J17.M1(S1:IN)
DA11: J08.H2 J17.R2(V2:IN)
DATA00: J18.E1(E1:OUT) ; also sheet 10
DATA01: J18.J2(J2:OUT) ; also sheet 10
DATA02: J18.L1(L1:OUT) ; also sheet 10
DATA03: J18.P2(P2:OUT) ; also sheet 11
DATA04: J18.S1(S1:OUT) ; also sheet 11
DATA05: J18.V2(V2:OUT) ; also sheet 11
DATA06: J19.E1(E1:OUT) ; also sheet 12
DATA07: J19.J2(J2:OUT) ; also sheet 12
DATA08: J19.L1(L1:OUT) ; also sheet 12
DATA09: J19.P2(P2:OUT) ; also sheet 13
DATA10: J19.S1(S1:OUT) ; also sheet 13
DATA11: J19.V2(V2:OUT) ; also sheet 13
DATA_ADD00: J16.E1(E1:OUT) ; also sheet 10
DATA_ADD01: J16.J2(J2:OUT) ; also sheet 10
DATA_ADD02: J16.L1(L1:OUT) ; also sheet 10
DATA_ADD03: J16.P2(P2:OUT) ; also sheet 11
DATA_ADD04: J16.S1(S1:OUT) ; also sheet 11
DATA_ADD05: J16.V2(V2:OUT) ; also sheet 11
DATA_ADD06: J17.E1(E1:OUT) ; also sheet 12
DATA_ADD07: J17.J2(J2:OUT) ; also sheet 12
DATA_ADD08: J17.L1(L1:OUT) ; also sheet 12
DATA_ADD09: J17.P2(P2:OUT) ; also sheet 13
DATA_ADD10: J17.S1(S1:OUT) ; also sheet 13
DATA_ADD11: J17.V2(V2:OUT) ; also sheet 13
DATA_IN_: J15.V2(V2:OUT) ; also sheet 5
EDA0: J10.V2 J11.H2 J20.K2(P2:IN)
EDA1: J10.T2 J11.E2 J20.M1(S1:IN)
EDA2: J10.S2 J11.D2 J20.R2(V2:IN)
EXT_DATA_ADD0: J20.P2(P2:OUT) ; also sheet 21
EXT_DATA_ADD1: J20.S1(S1:OUT) ; also sheet 21
EXT_DATA_ADD2: J20.V2(V2:OUT) ; also sheet 21
GND [Suppply]: H07.E2(SLOW) H07.L2(SLOW) H07.R2(SLOW) H08.E2(SLOW) H08.L2(SLOW) H08.R2(SLOW) H09.E2(SLOW) H09.L2(SLOW) H09.R2(SLOW) H10.E2(SLOW) H10.L2(SLOW) H10.R2(SLOW) H11.E2(SLOW) H11.L2(SLOW) H11.R2(SLOW) H12.E2(SLOW) H12.L2(SLOW) H12.R2(SLOW) H13.E2(SLOW) H13.L2(SLOW) H13.R2(SLOW) H14.E2(SLOW) H14.L2(SLOW) H14.R2(SLOW) H15.E2(SLOW) H15.L2(SLOW) H15.R2(SLOW) H16.E2(SLOW) H16.L2(SLOW) H16.R2(SLOW) H17.E2(SLOW) H17.L2(SLOW) H17.R2(SLOW) H18.E2(SLOW) H18.L2(SLOW) H18.R2(SLOW) H19.E2(SLOW) H19.L2(SLOW) H19.R2(SLOW) H20.E2(SLOW) H20.L2(SLOW) ; also sheet 2,5,9,10,11,12,13,15,17,18,23,26,27,30,33,34,35,39
IN00: J05.D2 J13.A1(E1:IN)
IN01: J05.E2 J13.D2(J2:IN)
IN02: J05.H2 J13.F1(L1:IN)
IN03: J05.K2 J13.K2(P2:IN)
IN04: J05.M2 J13.M1(S1:IN)
IN05: J05.P2 J13.R2(V2:IN)
IN06: J05.S2 J14.A1(E1:IN)
IN07: J05.T2 J14.D2(J2:IN)
IN08: J05.V2 J14.F1(L1:IN)
IN09: J06.D2 J14.K2(P2:IN)
IN10: J06.E2 J14.M1(S1:IN)
IN11: J06.H2 J14.R2(V2:IN)
INITIALIZE_: H12.U2(IN2) ; also sheet 2,26,30,32,35,36,37,38,39
INPUT_BUS00: J13.E1(E1:OUT) ; also sheet 10
INPUT_BUS01: J13.J2(J2:OUT) ; also sheet 10
INPUT_BUS02: J13.L1(L1:OUT) ; also sheet 10
INPUT_BUS03: J13.P2(P2:OUT) ; also sheet 11
INPUT_BUS04: J13.S1(S1:OUT) ; also sheet 11
INPUT_BUS05: J13.V2(V2:OUT) ; also sheet 11
INPUT_BUS06: J14.E1(E1:OUT) ; also sheet 12
INPUT_BUS07: J14.J2(J2:OUT) ; also sheet 12
INPUT_BUS08: J14.L1(L1:OUT) ; also sheet 12
INPUT_BUS09: J14.P2(P2:OUT) ; also sheet 13
INPUT_BUS10: J14.S1(S1:OUT) ; also sheet 13
INPUT_BUS11: J14.V2(V2:OUT) ; also sheet 13
INT_RQST: J15.J2(J2:OUT) ; also sheet 8
IO_BUS_IN00_: J13.B1(E1:IN2) ; also sheet 37,39
IO_BUS_IN01_: J13.E2(J2:IN2) ; also sheet 37,39
IO_BUS_IN02_: J13.H1(L1:IN2) ; also sheet 37,39
IO_BUS_IN03_: J13.L2(P2:IN2) ; also sheet 37,39
IO_BUS_IN04_: J13.N1(S1:IN2) ; also sheet 36,37,39
IO_BUS_IN05_: J13.S2(V2:IN2) ; also sheet 36,37,39
IO_BUS_IN06_: J14.B1(E1:IN2) ; also sheet 36,37,39
IO_BUS_IN07_: J14.E2(J2:IN2) ; also sheet 36,37,39
IO_BUS_IN08_: J14.H1(L1:IN2) ; also sheet 36,37,39
IO_BUS_IN09_: J14.L2(P2:IN2) ; also sheet 36,37,39
IO_BUS_IN10_: J14.N1(S1:IN2) ; also sheet 36,37,39
IO_BUS_IN11_: J14.S2(V2:IN2) ; also sheet 36,37,39
IO_BUS_IN_AC_CLR_: J15.H1(L1:IN2)
IO_BUS_IN_INT_: J15.E2(J2:IN2) ; also sheet 33,34,35,36,37,38
IO_BUS_IN_SKIP_: J15.B1(E1:IN2) ; also sheet 33,34,35,36,37,38
IO_SKIP: J15.E1(E1:OUT) ; also sheet 7
IOP1_: H11.H2(IN2) ; also sheet 2,5,34,37
IOP2_: H11.N2(IN2) ; also sheet 2,5,34,37
IOP4_: H11.U2(IN2) ; also sheet 2,5,37
IRQ: J06.M2 J15.D2(J2:IN)
LINE_: J15.P2(P2:OUT) ; also sheet 29
LINE_IN: J06.V2 J15.K2(P2:IN)
MB00: H13.H2(IN2) ; also sheet 9,21,30
MB01: H13.N2(IN2) ; also sheet 9,21,30
MB02: H13.U2(IN2) ; also sheet 9,21,30
MB03: H14.N2(IN2) ; also sheet 4,5,9,21,27,29,30,34,38
MB03_: H14.H2(IN2) ; also sheet 4,5,6,7,8,9,15,16,18,22,23,30,32,33,35,36,37
MB04: H15.H2(IN2) ; also sheet 5,9,21,22,30,38
MB04_: H14.U2(IN2) ; also sheet 5,8,9,15,16,18,23,27,29,30,32,33,34,35,36,37
MB05: H15.U2(IN2) ; also sheet 5,7,9,21,27,30,32,34,37
MB05_: H15.N2(IN2) ; also sheet 5,8,9,15,16,18,22,23,29,30,33,35,36,38
MB06: H16.N2(IN2) ; also sheet 5,7,9,16,21,22,27,30,33,38
MB06_: H16.H2(IN2) ; also sheet 5,8,9,15,18,22,23,29,30,32,34,35,36,37,38
MB07: H17.H2(IN2) ; also sheet 5,7,9,15,21,22,26,27,30,33,34,35,37,38
MB07_: H16.U2(IN2) ; also sheet 5,8,9,16,18,22,23,26,28,29,30,32,33,34,36
MB08: H17.U2(IN2) ; also sheet 6,7,9,15,21,22,26,27,30,33,34,36,37,38
MB08_: H17.N2(IN2) ; also sheet 6,7,8,9,16,18,22,23,26,28,29,30,32,33,34,35
MB09: H18.H2(IN2) ; also sheet 2,5,6,9,21,22,27,29,30,37
MB10: H18.N2(IN2) ; also sheet 2,6,8,9,21,22,27,29,30,33,37
MB11: H18.U2(IN2) ; also sheet 2,6,9,21,22,27,29,30,33,37
ME05_: J13.U2(V2:IN4) ; also sheet 26
ME06_: J14.D1(E1:IN4) ; also sheet 22
ME07_: J14.H2(J2:IN4) ; also sheet 22
ME08_: J14.K1(L1:IN4) ; also sheet 22
ME09_: J14.N2(P2:IN4) ; also sheet 22
ME10_: J14.R1(S1:IN4) ; also sheet 22
ME11_: J14.U2(V2:IN4) ; also sheet 22
MEM_INCR: J08.T2 J20.A1(E1:IN)
MEMORY_INCREMENT: J20.E1(E1:OUT) ; also sheet 6,8
MP_INT_: J15.H2(J2:IN4) ; also sheet 30
MP_SKIP_: J15.D1(E1:IN4) ; also sheet 30
N$200: J16.E2(J2:IN2) J16.F2(J2:IN3) J16.H2(J2:IN4)
N$201: J16.N1(S1:IN2) J16.P1(S1:IN3) J16.R1(S1:IN4)
N$202: J16.B1(E1:IN2) J16.C1(E1:IN3) J16.D1(E1:IN4)
N$203: J16.H1(L1:IN2) J16.J1(L1:IN3) J16.K1(L1:IN4)
N$204: J16.L2(P2:IN2) J16.M2(P2:IN3) J16.N2(P2:IN4)
N$205: J16.S2(V2:IN2) J16.T2(V2:IN3) J16.U2(V2:IN4)
N$206: J17.N1(S1:IN2) J17.P1(S1:IN3) J17.R1(S1:IN4)
N$207: J17.B1(E1:IN2) J17.C1(E1:IN3) J17.D1(E1:IN4)
N$208: J17.E2(J2:IN2) J17.F2(J2:IN3) J17.H2(J2:IN4)
N$209: J17.H1(L1:IN2) J17.J1(L1:IN3) J17.K1(L1:IN4)
N$210: J17.L2(P2:IN2) J17.M2(P2:IN3) J17.N2(P2:IN4)
N$211: J17.S2(V2:IN2) J17.T2(V2:IN3) J17.U2(V2:IN4)
N$212: J19.S2(V2:IN2) J19.T2(V2:IN3) J19.U2(V2:IN4)
N$213: J19.N1(S1:IN2) J19.P1(S1:IN3) J19.R1(S1:IN4)
N$214: J19.L2(P2:IN2) J19.M2(P2:IN3) J19.N2(P2:IN4)
N$215: J19.H1(L1:IN2) J19.J1(L1:IN3) J19.K1(L1:IN4)
N$216: J19.E2(J2:IN2) J19.F2(J2:IN3) J19.H2(J2:IN4)
N$217: J19.B1(E1:IN2) J19.C1(E1:IN3) J19.D1(E1:IN4)
N$218: J18.S2(V2:IN2) J18.T2(V2:IN3) J18.U2(V2:IN4)
N$219: J18.N1(S1:IN2) J18.P1(S1:IN3) J18.R1(S1:IN4)
N$220: J18.L2(P2:IN2) J18.M2(P2:IN3) J18.N2(P2:IN4)
N$221: J18.H1(L1:IN2) J18.J1(L1:IN3) J18.K1(L1:IN4)
N$222: J18.E2(J2:IN2) J18.F2(J2:IN3) J18.H2(J2:IN4)
N$223: J18.B1(E1:IN2) J18.C1(E1:IN3) J18.D1(E1:IN4)
N$243: J15.L2(P2:IN2) J15.M2(P2:IN3) J15.N2(P2:IN4)
N$245: J15.S2(V2:IN2) J15.T2(V2:IN3) J15.U2(V2:IN4)
N$246: J15.N1(S1:IN2) J15.P1(S1:IN3) J15.R1(S1:IN4)
N$250: J20.B1(E1:IN2) J20.C1(E1:IN3) J20.D1(E1:IN4)
N$253: J20.E2(J2:IN2) J20.F2(J2:IN3) J20.H2(J2:IN4)
N$254: J20.H1(L1:IN2) J20.J1(L1:IN3) J20.K1(L1:IN4)
N$259: J20.N1(S1:IN2) J20.P1(S1:IN3) J20.R1(S1:IN4)
N$260: J20.L2(P2:IN2) J20.M2(P2:IN3) J20.N2(P2:IN4)
N$261: J20.S2(V2:IN2) J20.T2(V2:IN3) J20.U2(V2:IN4)
RUN_: H19.H2(IN2) ; also sheet 2
SKIPB: J06.K2 J15.A1(E1:IN)
TS1_: H12.N2(IN2) ; also sheet 2
TS3_: H12.H2(IN2) ; also sheet 2
TT0_: J13.P1(S1:IN3) ; also sheet 15
TT1_: J13.T2(V2:IN3) ; also sheet 15
TT2_: J14.C1(E1:IN3) ; also sheet 15
TT3_: J14.F2(J2:IN3) ; also sheet 15
TT4_: J14.J1(L1:IN3) ; also sheet 15
TT5_: J14.M2(P2:IN3) ; also sheet 15
TT6_: J14.P1(S1:IN3) ; also sheet 15
TT7_: J14.T2(V2:IN3) ; also sheet 15
TT_AC_CLR_: J15.J1(L1:IN3) ; also sheet 15
TT_INST_: H19.N2(IN2) ; also sheet 2,9,29
TT_INT_: J15.F2(J2:IN3) ; also sheet 16
TT_SKIP_: J15.C1(E1:IN3) ; also sheet 16
WC_OVERFLOW_: H19.U2(IN2) ; also sheet 8
Unconnected: H20.R2(SLOW) H20.S2(OUT) H20.T2(IN1) H20.U2(IN2) H20.V2(IN3) J08.V2

### Notes on the sheet
- 8i-00009?
- D-BS-8i-0-10 I/O Level Converter
- 1. For ka8i, substitute D-BS-ka8i-0-1 for this print.
- 2. G717 is always placed at the end of the I/O bus.
- (Place G717 in location J02 if no options on the I/O bus.)

## Sheet 15 of 40
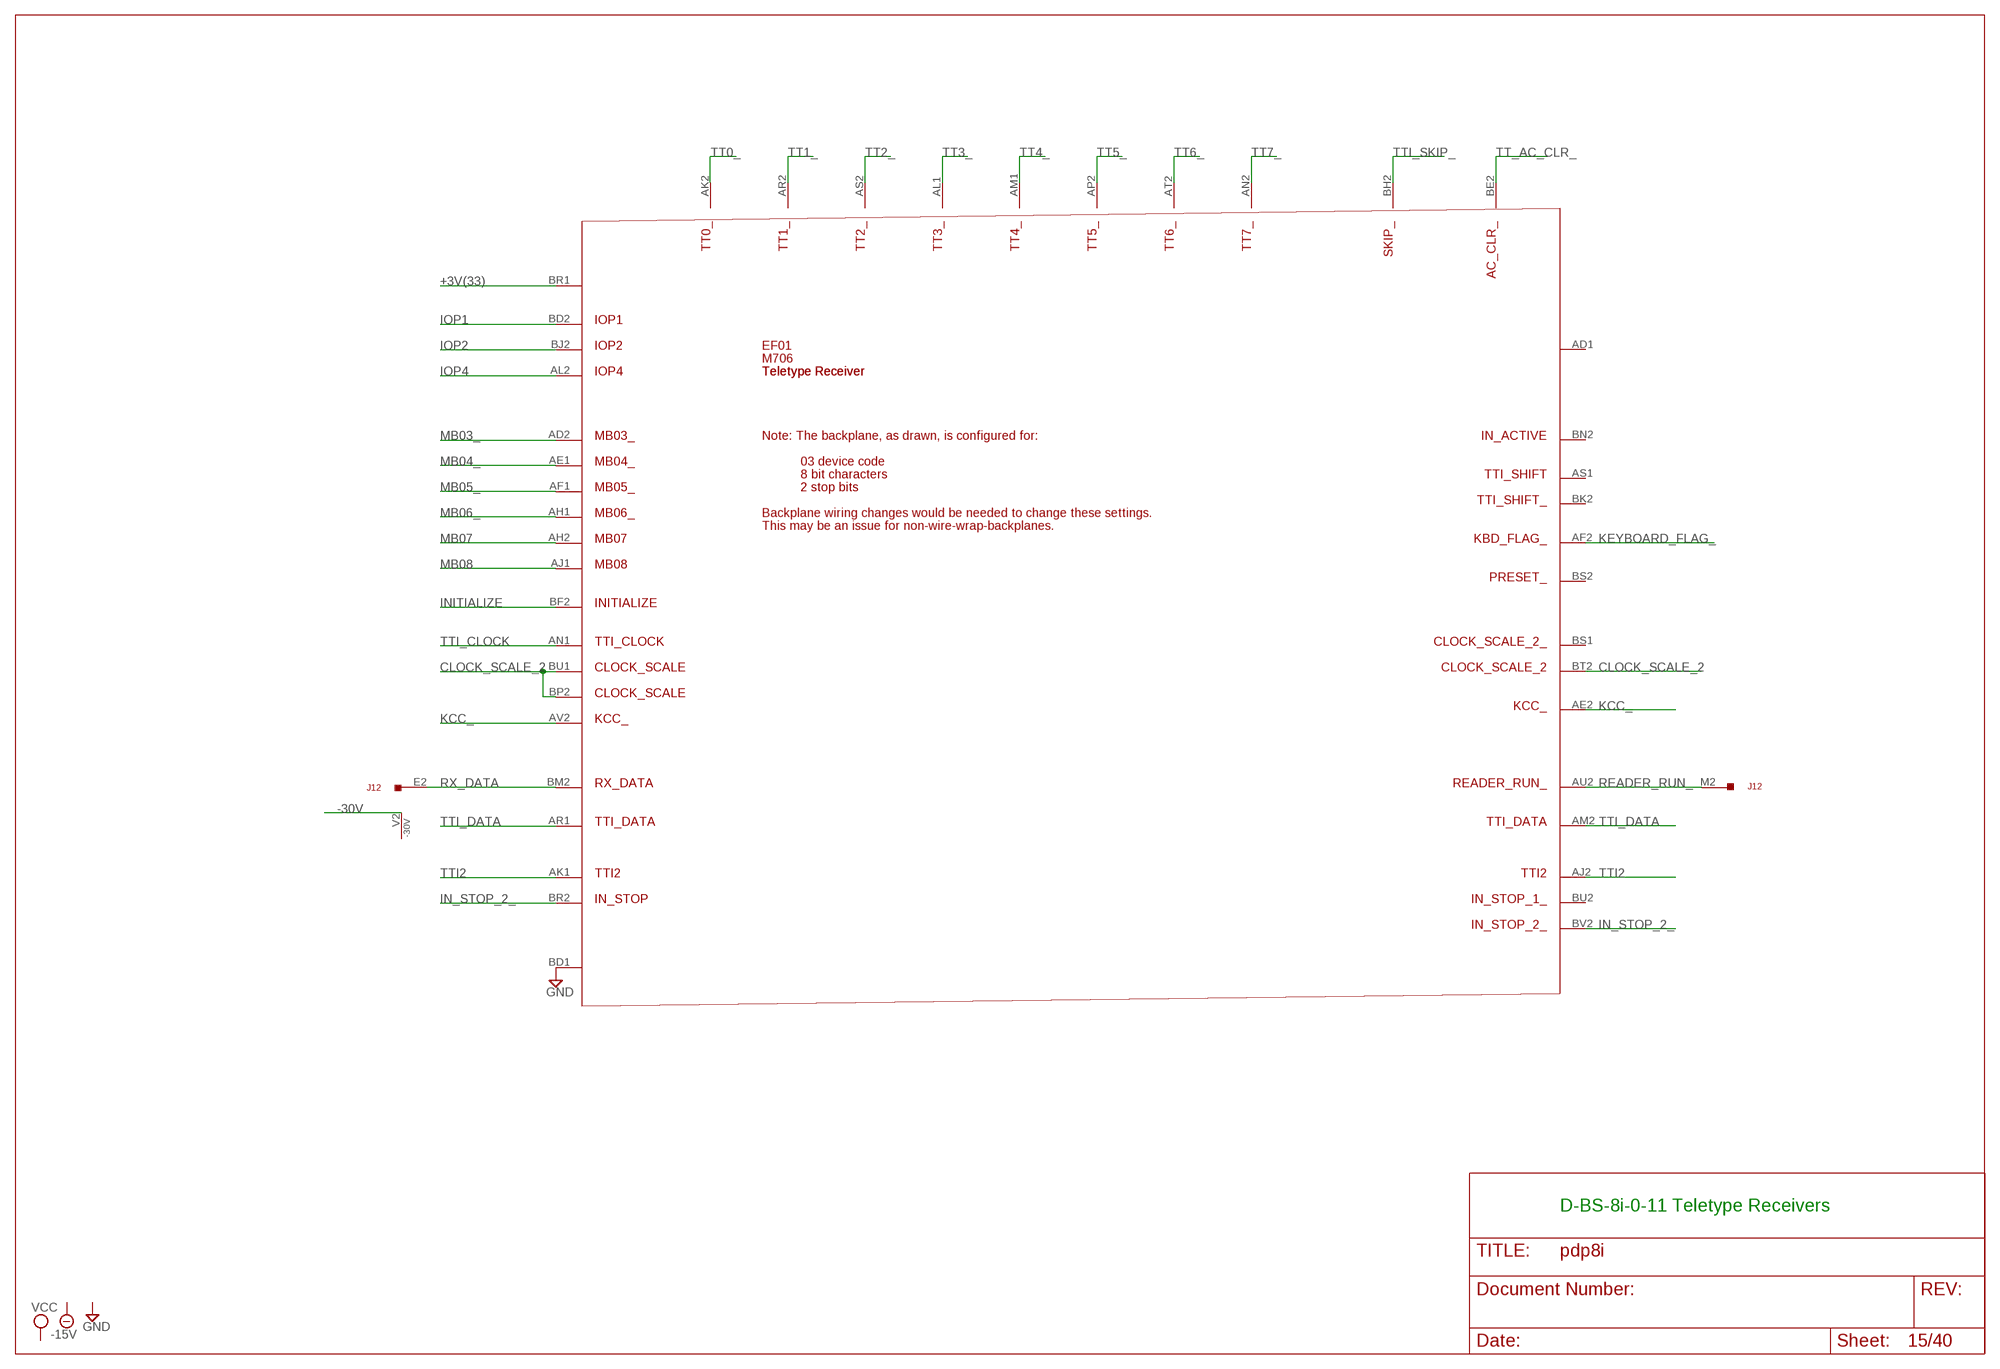
[diagram p15: schematic, sheet 15]

### Parts
EF01  M706  [H807-2]
J12  W076  [H807]

### Nets
+3V(33): EF01.BR1 ; also sheet 2,16
-30V [Suppply]: J12.V2(-30V) ; also sheet 17,18,23,33
CLOCK_SCALE_2: EF01.BP2 EF01.BT2 EF01.BU1
GND [Suppply]: EF01.BD1 ; also sheet 2,5,9,10,11,12,13,14,17,18,23,26,27,30,33,34,35,39
IN_STOP_2_: EF01.BR2 EF01.BV2
INITIALIZE: EF01.BF2 ; also sheet 2,16,33,34,36
IOP1: EF01.BD2 ; also sheet 2,16,30,33,34,35,36
IOP2: EF01.BJ2 ; also sheet 2,16,32,33,34,35,36
IOP4: EF01.AL2 ; also sheet 2,16,30,33,34,35,36
KCC_: EF01.AE2 EF01.AV2
KEYBOARD_FLAG_: EF01.AF2 ; also sheet 16
MB03_: EF01.AD2 ; also sheet 4,5,6,7,8,9,14,16,18,22,23,30,32,33,35,36,37
MB04_: EF01.AE1 ; also sheet 5,8,9,14,16,18,23,27,29,30,32,33,34,35,36,37
MB05_: EF01.AF1 ; also sheet 5,8,9,14,16,18,22,23,29,30,33,35,36,38
MB06_: EF01.AH1 ; also sheet 5,8,9,14,18,22,23,29,30,32,34,35,36,37,38
MB07: EF01.AH2 ; also sheet 5,7,9,14,21,22,26,27,30,33,34,35,37,38
MB08: EF01.AJ1 ; also sheet 6,7,9,14,21,22,26,27,30,33,34,36,37,38
READER_RUN_: EF01.AU2 J12.M2
RX_DATA: EF01.BM2 J12.E2
TT0_: EF01.AK2 ; also sheet 14
TT1_: EF01.AR2 ; also sheet 14
TT2_: EF01.AS2 ; also sheet 14
TT3_: EF01.AL1 ; also sheet 14
TT4_: EF01.AM1 ; also sheet 14
TT5_: EF01.AP2 ; also sheet 14
TT6_: EF01.AT2 ; also sheet 14
TT7_: EF01.AN2 ; also sheet 14
TT_AC_CLR_: EF01.BE2 ; also sheet 14
TTI2: EF01.AJ2 EF01.AK1
TTI_CLOCK: EF01.AN1 ; also sheet 16
TTI_DATA: EF01.AM2 EF01.AR1
TTI_SKIP_: EF01.BH2 ; also sheet 16
Unconnected: EF01.AD1 EF01.AS1 EF01.BK2 EF01.BN2 EF01.BS1 EF01.BS2 EF01.BU2 J12.K2 J12.U2

### Notes on the sheet
- Teletype Receiver
- Note: The backplane, as drawn, is configured for:
- 03 device code
- 8 bit characters
- 2 stop bits
- Backplane wiring changes would be needed to change these settings.
- This may be an issue for non-wire-wrap-backplanes.
- D-BS-8i-0-11 Teletype Receivers

## Sheet 16 of 40
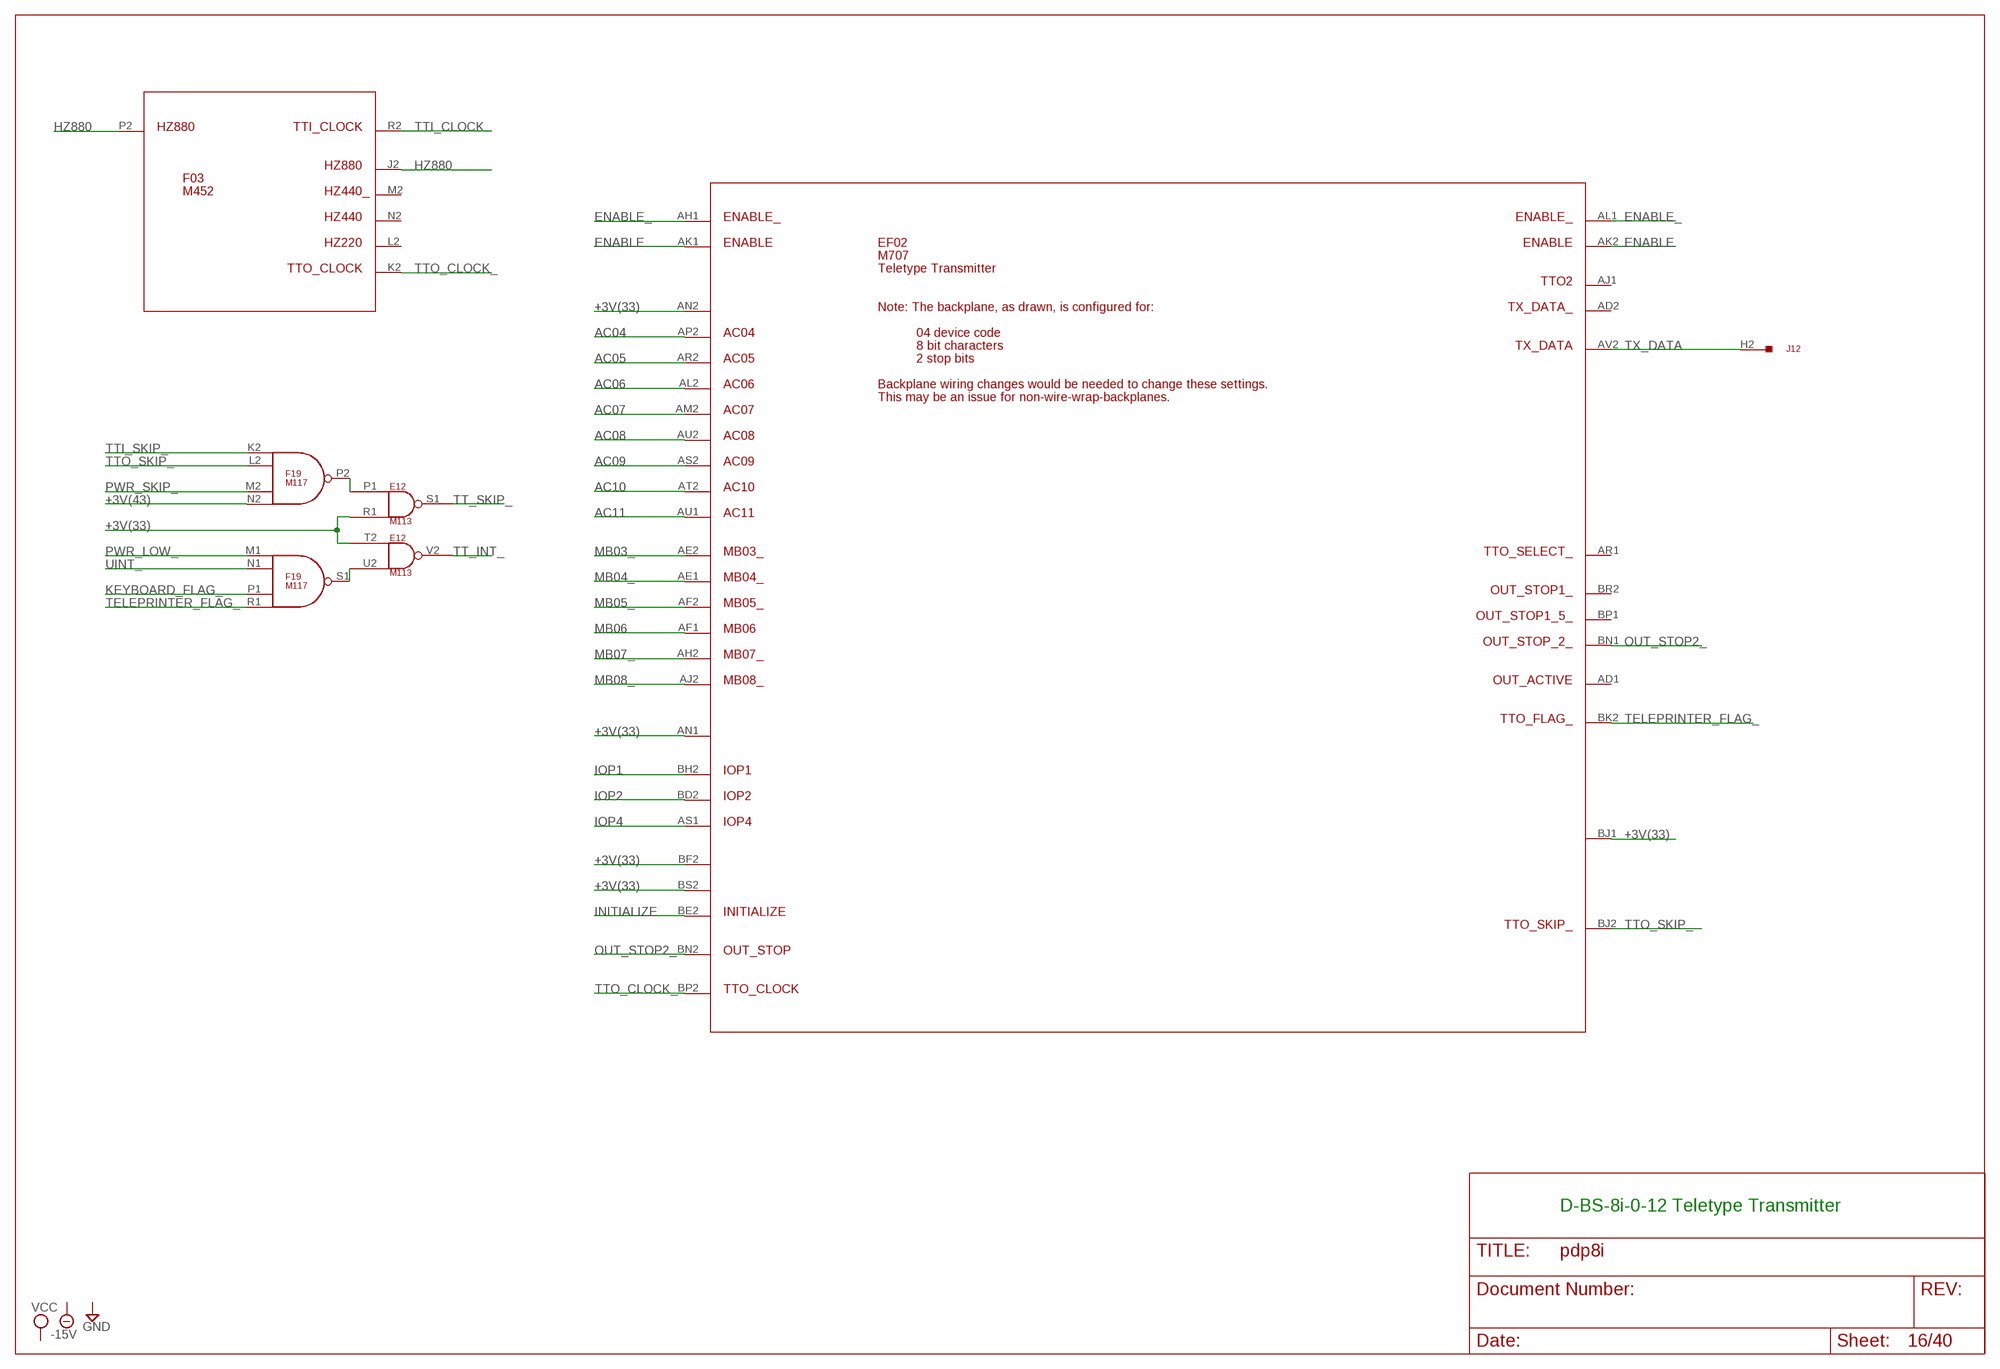
[diagram p16: schematic, sheet 16]

### Parts
EF02  M707  [H807-2]
F03  M452  [H807]

### Nets
+3V(33): E12.R1(S1:IN2) E12.T2(V2:IN1) EF02.AN1 EF02.AN2 EF02.BF2 EF02.BJ1 EF02.BS2 ; also sheet 2,15
+3V(43): F19.N2(P2:IN4) ; also sheet 2,5,8
AC04: EF02.AP2 ; also sheet 9,14,28,33,35,37
AC05: EF02.AR2 ; also sheet 9,14,28,33,35,37
AC06: EF02.AL2 ; also sheet 9,14,28,33,35,37
AC07: EF02.AM2 ; also sheet 9,14,28,33,35,37
AC08: EF02.AU2 ; also sheet 9,14,28,33,35,37
AC09: EF02.AS2 ; also sheet 9,14,28,33,35,37
AC10: EF02.AT2 ; also sheet 9,14,28,33,35,37
AC11: EF02.AU1 ; also sheet 9,14,28,33,35,37
ENABLE: EF02.AK1 EF02.AK2
ENABLE_: EF02.AH1 EF02.AL1
HZ880: F03.J2 F03.P2
INITIALIZE: EF02.BE2 ; also sheet 2,15,33,34,36
IOP1: EF02.BH2 ; also sheet 2,15,30,33,34,35,36
IOP2: EF02.BD2 ; also sheet 2,15,32,33,34,35,36
IOP4: EF02.AS1 ; also sheet 2,15,30,33,34,35,36
KEYBOARD_FLAG_: F19.P1(S1:IN3) ; also sheet 15
MB03_: EF02.AE2 ; also sheet 4,5,6,7,8,9,14,15,18,22,23,30,32,33,35,36,37
MB04_: EF02.AE1 ; also sheet 5,8,9,14,15,18,23,27,29,30,32,33,34,35,36,37
MB05_: EF02.AF2 ; also sheet 5,8,9,14,15,18,22,23,29,30,33,35,36,38
MB06: EF02.AF1 ; also sheet 5,7,9,14,21,22,27,30,33,38
MB07_: EF02.AH2 ; also sheet 5,8,9,14,18,22,23,26,28,29,30,32,33,34,36
MB08_: EF02.AJ2 ; also sheet 6,7,8,9,14,18,22,23,26,28,29,30,32,33,34,35
N$265: E12.U2(V2:IN2) F19.S1(S1:OUT)
N$266: E12.P1(S1:IN1) F19.P2(P2:OUT)
OUT_STOP2_: EF02.BN1 EF02.BN2
PWR_LOW_: F19.M1(S1:IN1) ; also sheet 32
PWR_SKIP_: F19.M2(P2:IN3) ; also sheet 32
TELEPRINTER_FLAG_: EF02.BK2 F19.R1(S1:IN4)
TT_INT_: E12.V2(V2:OUT) ; also sheet 14
TT_SKIP_: E12.S1(S1:OUT) ; also sheet 14
TTI_CLOCK: F03.R2 ; also sheet 15
TTI_SKIP_: F19.K2(P2:IN1) ; also sheet 15
TTO_CLOCK_: EF02.BP2 F03.K2
TTO_SKIP_: EF02.BJ2 F19.L2(P2:IN2)
TX_DATA: EF02.AV2 J12.H2
UINT_: F19.N1(S1:IN2) ; also sheet 26
Unconnected: EF02.AD1 EF02.AD2 EF02.AJ1 EF02.AR1 EF02.BP1 EF02.BR2 F03.L2 F03.M2 F03.N2

### Notes on the sheet
- Note: The backplane, as drawn, is configured for:
- 04 device code
- 8 bit characters
- 2 stop bits
- Backplane wiring changes would be needed to change these settings.
- This may be an issue for non-wire-wrap-backplanes.
- D-BS-8i-0-12 Teletype Transmitter

## Sheet 17 of 40
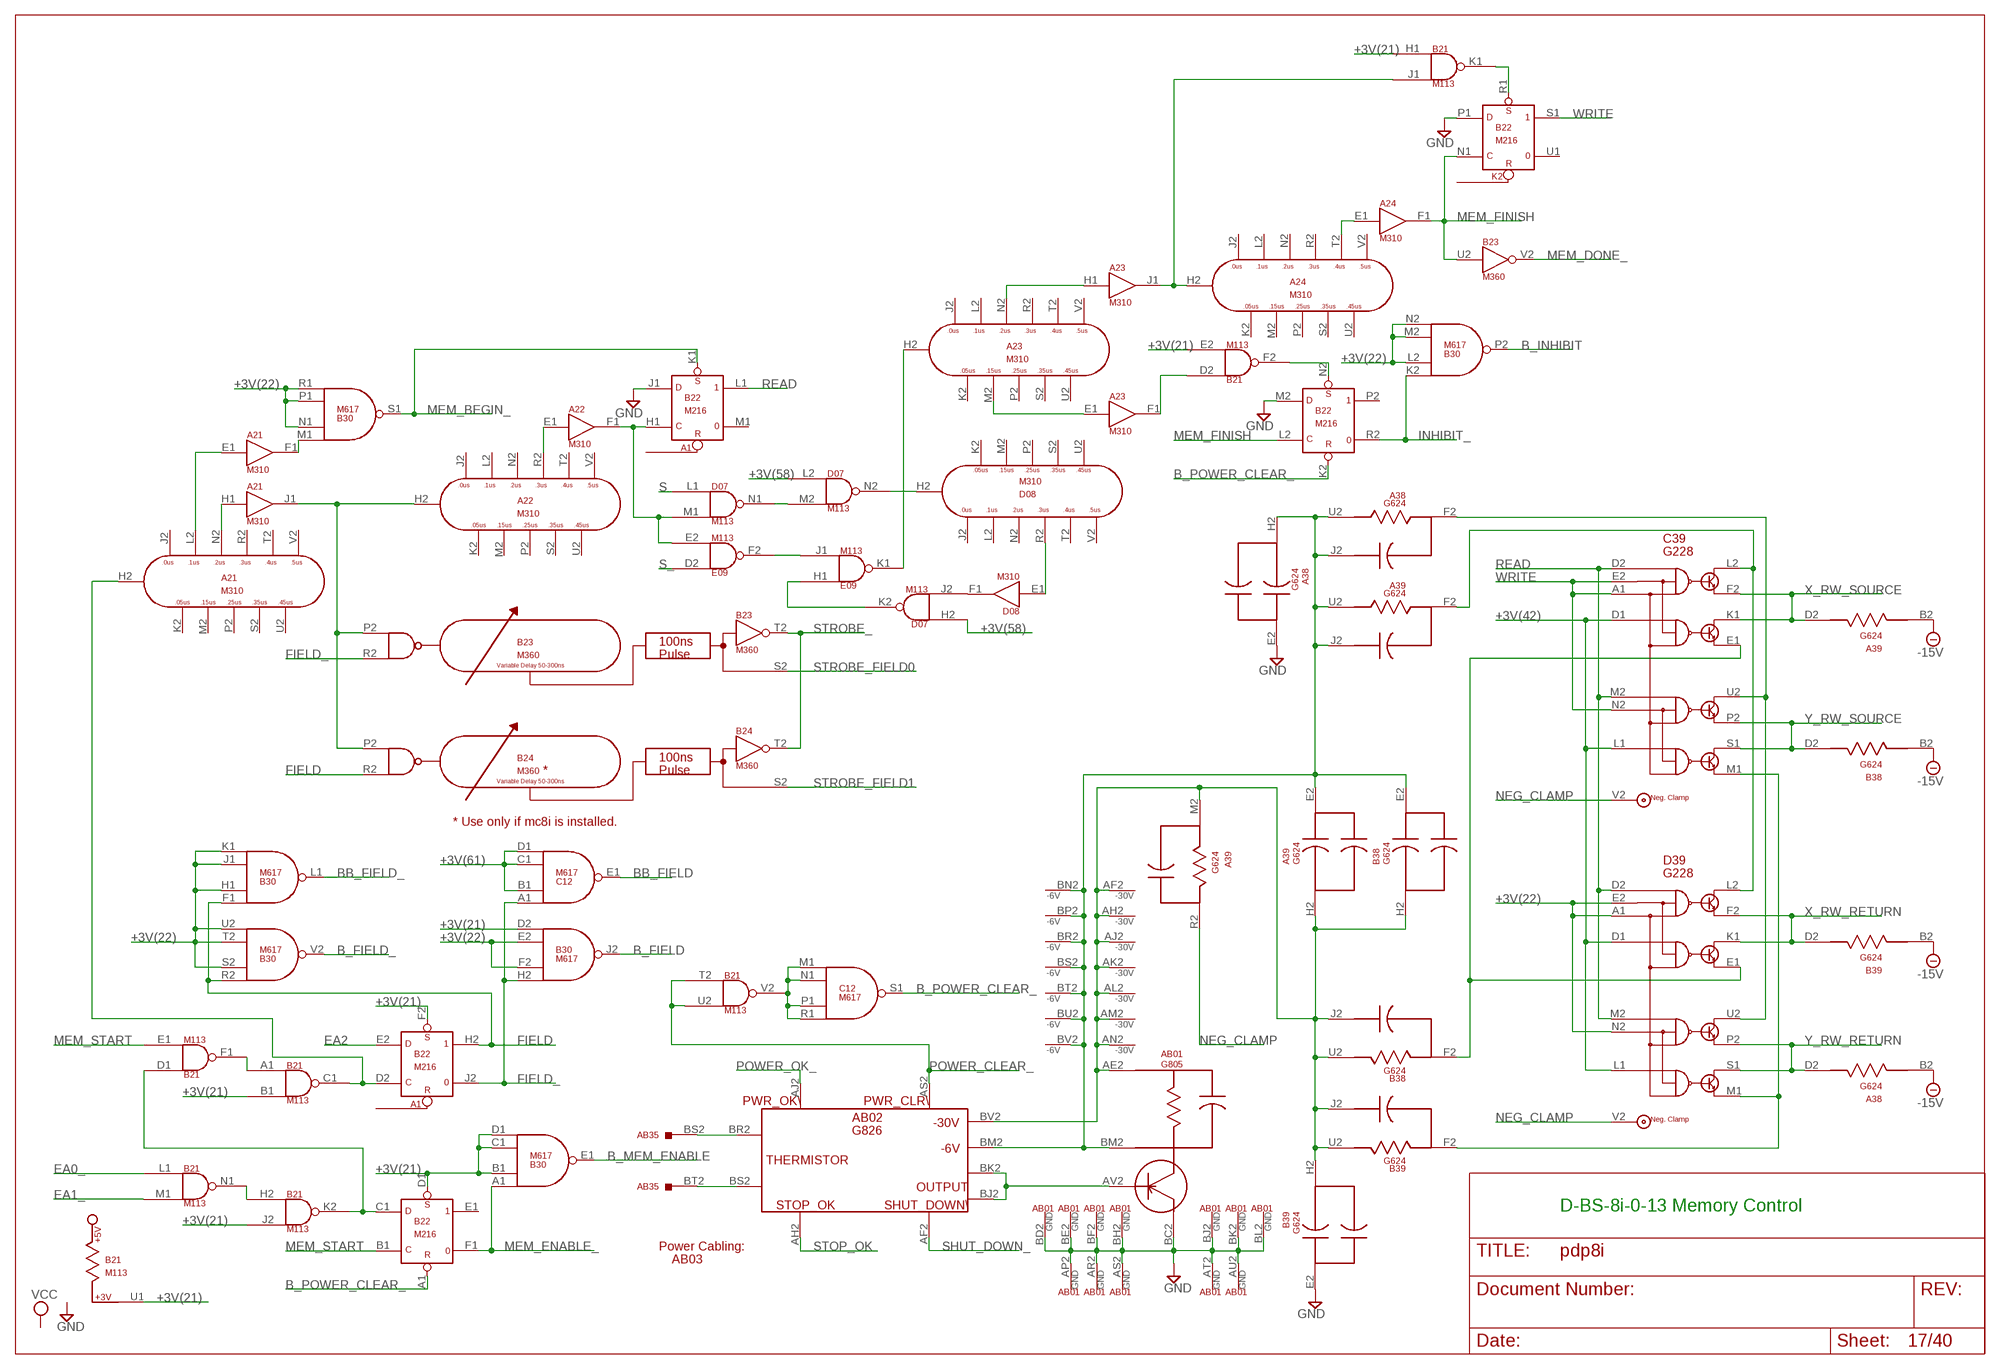
[diagram p17: schematic, sheet 17]

### Parts
A21  M310  [H807]
A22  M310  [H807]
A23  M310  [H807]
A24  M310  [H807]
A38  G624  [H807]
A39  G624  [H807]
AB01  G805  [H807-2]
AB02  G826  [H807-2]
AB03  G792  [H807-2]
AB35  W025  [H807-2]
B21  M113  [H807]
B22  M216  M206X  [H807]
B23  M360  [H807]
B24  M360  [H807]
B38  G624  [H807]
B39  G624  [H807]
C39  G228  [H807]
D08  M310  [H807]
D39  G228  [H807]

### Nets
+3V(21): B21.B1(C1:IN2) B21.E2(F2:IN2) B21.H1(K1:IN1) B21.J2(K2:IN2) B21.U1 B22.D1(E1:S) B22.F2(H2:S) B30.B1(E1:IN2) B30.C1(E1:IN3) B30.D1(E1:IN4) B30.D2(J2:IN1)
+3V(22): B30.E2(J2:IN2) B30.F2(J2:IN3) B30.H1(L1:IN2) B30.J1(L1:IN3) B30.K1(L1:IN4) B30.L2(P2:IN2) B30.M2(P2:IN3) B30.N1(S1:IN2) B30.N2(P2:IN4) B30.P1(S1:IN3) B30.R1(S1:IN4) B30.S2(V2:IN2) B30.T2(V2:IN3) B30.U2(V2:IN4) D39.A1 D39.E2 D39.N2 ; also sheet 1
+3V(42): C39.D1 C39.L1 D39.D1 D39.L1 ; also sheet 1,5,8,9
+3V(58): D07.H2(K2:IN1) D07.L2(N2:IN1) ; also sheet 2,3,29
+3V(61): C12.B1(E1:IN2) C12.C1(E1:IN3) C12.D1(E1:IN4) ; also sheet 2,8
-6V [Suppply]: A38.H2 A38.J2 A38.U2 A39.E2 A39.J2 A39.U2 AB01.BM2(-6V) AB01.BN2(-6V) AB01.BP2(-6V) AB01.BR2(-6V) AB01.BS2(-6V) AB01.BT2(-6V) AB01.BU2(-6V) AB01.BV2(-6V) AB02.BM2(-6V) B38.E2 ; also sheet 18,23
-15V [Suppply]: A38.B2 A39.B2 B38.B2 B39.B2 ; also sheet 33,36
-30V [Suppply]: A39.H2 A39.M2 AB01.AE2(-30V) AB01.AF2(-30V) AB01.AH2(-30V) AB01.AJ2(-30V) AB01.AK2(-30V) AB01.AL2(-30V) AB01.AM2(-30V) AB01.AN2(-30V) AB02.BV2(-30V) B38.H2 B38.J2 B38.U2 B39.H2 B39.J2 B39.U2 ; also sheet 15,18,23,33
B_FIELD: B30.J2(J2:OUT) ; also sheet 18,23,24,25
B_FIELD_: B30.V2(V2:OUT) ; also sheet 18,19,20
B_INHIBIT: B30.P2(P2:OUT) ; also sheet 18,23
B_MEM_ENABLE: B30.E1(E1:OUT) ; also sheet 18
B_POWER_CLEAR_: B22.A1(E1:R) B22.K2(P2:R) C12.S1(S1:OUT) ; also sheet 2,27
BB_FIELD: C12.E1(E1:OUT) ; also sheet 24,25
BB_FIELD_: B30.L1(L1:OUT) ; also sheet 19,20
EA0_: B21.L1(N1:IN1) ; also sheet 21
EA1_: B21.M1(N1:IN2) ; also sheet 21
EA2: B22.E2(H2:D) ; also sheet 21
FIELD: B22.H2 B24.R2(R) B30.F1(L1:IN1) B30.R2(V2:IN1)
FIELD_: B22.J2 B23.R2(R) B30.H2(J2:IN4) C12.A1(E1:IN1)
GND [Suppply]: A38.E2 AB01.AP2(GND) AB01.AR2(GND) AB01.AS2(GND) AB01.AT2(GND) AB01.AU2(GND) AB01.BC2(GND) AB01.BD2(GND) AB01.BE2(GND) AB01.BF2(GND) AB01.BH2(GND) AB01.BJ2(GND) AB01.BK2(GND) AB01.BL2(GND) B22.J1(L1:D) B22.M2(P2:D) B22.P1(S1:D) B39.E2 ; also sheet 2,5,9,10,11,12,13,14,15,18,23,26,27,30,33,34,35,39
INHIBIT_: B22.R2 B30.K2(P2:IN1)
MEM_BEGIN_: B22.K1(L1:S) B30.S1(S1:OUT) ; also sheet 18
MEM_DONE_: B23.V2(OUT) ; also sheet 2,8,21,29
MEM_ENABLE_: B22.F1 B30.A1(E1:IN1)
MEM_FINISH: A24.F1(F1:OUT) B22.L2(P2:C) B22.N1(S1:C) B23.U2(IN)
MEM_START: B21.E1(F1:IN2) B22.B1(E1:C) ; also sheet 2
N$267: AB02.BS2 AB35.BT2
N$268: AB02.BR2 AB35.BS2
N$269: AB01.AV2 AB02.BJ2 AB02.BK2
N$270: B21.V2(V2:OUT) C12.M1(S1:IN1) C12.N1(S1:IN2) C12.P1(S1:IN3) C12.R1(S1:IN4)
N$271: B21.H2(K2:IN1) B21.N1(N1:OUT)
N$272: B21.D1(F1:IN1) B21.K2(K2:OUT) B22.C1(E1:D)
N$273: B21.A1(C1:IN1) B21.F1(F1:OUT)
N$274: A21.H2(H2:H2) B21.C1(C1:OUT) B22.D2(H2:C)
N$275: A23.H1(J1:IN) A23.N2(H2:N2)
N$276: A38.F2 C39.U2 D39.U2
N$277: A21.E1(F1:IN) A21.L2(H2:L2)
N$278: A39.F2 C39.L2 D39.L2
N$279: B39.F2 C39.M1 D39.M1
N$280: B38.F2 C39.E1 D39.E1
N$281: A21.H1(J1:IN) A21.N2(H2:N2)
N$282: A21.F1(F1:OUT) B30.M1(S1:IN1)
N$283: A21.J1(J1:OUT) A22.H2(H2:H2) B23.P2(P) B24.P2(P)
N$284: A22.E1(F1:IN) A22.R2(H2:R2)
N$285: A22.F1(F1:OUT) B22.H1(L1:C) D07.M1(N1:IN2) E09.E2(F2:IN2)
N$286: E09.F2(F2:OUT) E09.J1(K1:IN2)
N$287: D07.M2(N2:IN2) D07.N1(N1:OUT)
N$288: D07.N2(N2:OUT) D08.H2(H2:H2)
N$289: D08.E1(F1:IN) D08.R2(H2:R2)
N$290: D07.K2(K2:OUT) E09.H1(K1:IN1)
N$291: D07.J2(K2:IN2) D08.F1(F1:OUT)
N$292: A23.H2(H2:H2) E09.K1(K1:OUT)
N$293: A23.E1(F1:IN) A23.M2(H2:M2)
N$294: A23.J1(J1:OUT) A24.H2(H2:H2) B21.J1(K1:IN2)
N$295: A24.E1(F1:IN) A24.T2(H2:T2)
N$296: B21.F2(F2:OUT) B22.N2(P2:S)
N$297: A23.F1(F1:OUT) B21.D2(F2:IN1)
N$298: B21.K1(K1:OUT) B22.R1(S1:S)
NEG_CLAMP: A39.R2 C39.V2 D39.V2 ; also sheet 19,20,24,25
POWER_CLEAR_: AB02.AS2 B21.T2(V2:IN1) B21.U2(V2:IN2)
POWER_OK_: AB02.AJ2 ; also sheet 2
READ: B22.L1 C39.D2 C39.M2 D39.D2 D39.M2
S: D07.L1(N1:IN1) ; also sheet 3,29
S_: E09.D2(F2:IN1) ; also sheet 3,29
SHUT_DOWN_: AB02.AF2 ; also sheet 32
STOP_OK: AB02.AH2 ; also sheet 2,32
STROBE_: B23.T2(T) B24.T2(T) ; also sheet 2,8,21
STROBE_FIELD0: B23.S2(S) ; also sheet 18
STROBE_FIELD1: B24.S2(S) ; also sheet 18
WRITE: B22.S1 C39.A1 C39.E2 C39.N2
X_RW_RETURN: B39.D2 D39.F2 D39.K1 ; also sheet 19,24
X_RW_SOURCE: A39.D2 C39.F2 C39.K1 ; also sheet 19,24
Y_RW_RETURN: A38.D2 D39.P2 D39.S1 ; also sheet 20,25
Y_RW_SOURCE: B38.D2 C39.P2 C39.S1 ; also sheet 20,25
Unconnected: A21.J2(H2:J2) A21.K2(H2:K2) A21.M2(H2:M2) A21.P2(H2:P2) A21.R2(H2:R2) A21.S2(H2:S2) A21.T2(H2:T2) A21.U2(H2:U2) A21.V2(H2:V2) A22.H1(J1:IN) A22.J1(J1:OUT) A22.J2(H2:J2) A22.K2(H2:K2) A22.L2(H2:L2) A22.M2(H2:M2) A22.N2(H2:N2) A22.P2(H2:P2) A22.S2(H2:S2) A22.T2(H2:T2) A22.U2(H2:U2) A22.V2(H2:V2) A23.J2(H2:J2) A23.K2(H2:K2) A23.L2(H2:L2) A23.P2(H2:P2) A23.R2(H2:R2) A23.S2(H2:S2) A23.T2(H2:T2) A23.U2(H2:U2) A23.V2(H2:V2) A24.H1(J1:IN) A24.J1(J1:OUT) A24.J2(H2:J2) A24.K2(H2:K2) A24.L2(H2:L2) A24.M2(H2:M2) A24.N2(H2:N2) A24.P2(H2:P2) A24.R2(H2:R2) A24.S2(H2:S2) A24.U2(H2:U2) A24.V2(H2:V2) A39.K2 A39.T2 AB35.AA2 AB35.AB2 AB35.AU2 AB35.AV2 AB35.BA2 AB35.BB2 AB35.BU2 AB35.BV2 B22.E1 B22.M1 B22.P2 B22.S2(V2:C) B22.T2(V2:D) B22.U1 B22.U2(V2:S) B22.V1 B22.V2 B24.U2(IN) B24.V2(OUT) C39.F1(F1:H) C39.H1(F1:J) C39.H2(H2:H) C39.J1(F1:K) C39.J2(H2:J) C39.K2(H2:K) C39.N1(N1:H) C39.P1(N1:J) C39.R1(N1:K) C39.R2(R2:H) C39.S2(R2:J) C39.T2(R2:K) D08.H1(J1:IN) D08.J1(J1:OUT) D08.J2(H2:J2) D08.K2(H2:K2) D08.L2(H2:L2) D08.M2(H2:M2) D08.N2(H2:N2) D08.P2(H2:P2) D08.S2(H2:S2) D08.T2(H2:T2) D08.U2(H2:U2) D08.V2(H2:V2) D39.F1(F1:H) D39.H1(F1:J) D39.H2(H2:H) D39.J1(F1:K) D39.J2(H2:J) D39.K2(H2:K) D39.N1(N1:H) D39.P1(N1:J) D39.R1(N1:K) D39.R2(R2:H) D39.S2(R2:J) D39.T2(R2:K)

### Notes on the sheet
- *
- * Use only if mc8i is installed.
- D-BS-8i-0-13 Memory Control
- Power Cabling:

## Sheet 18 of 40
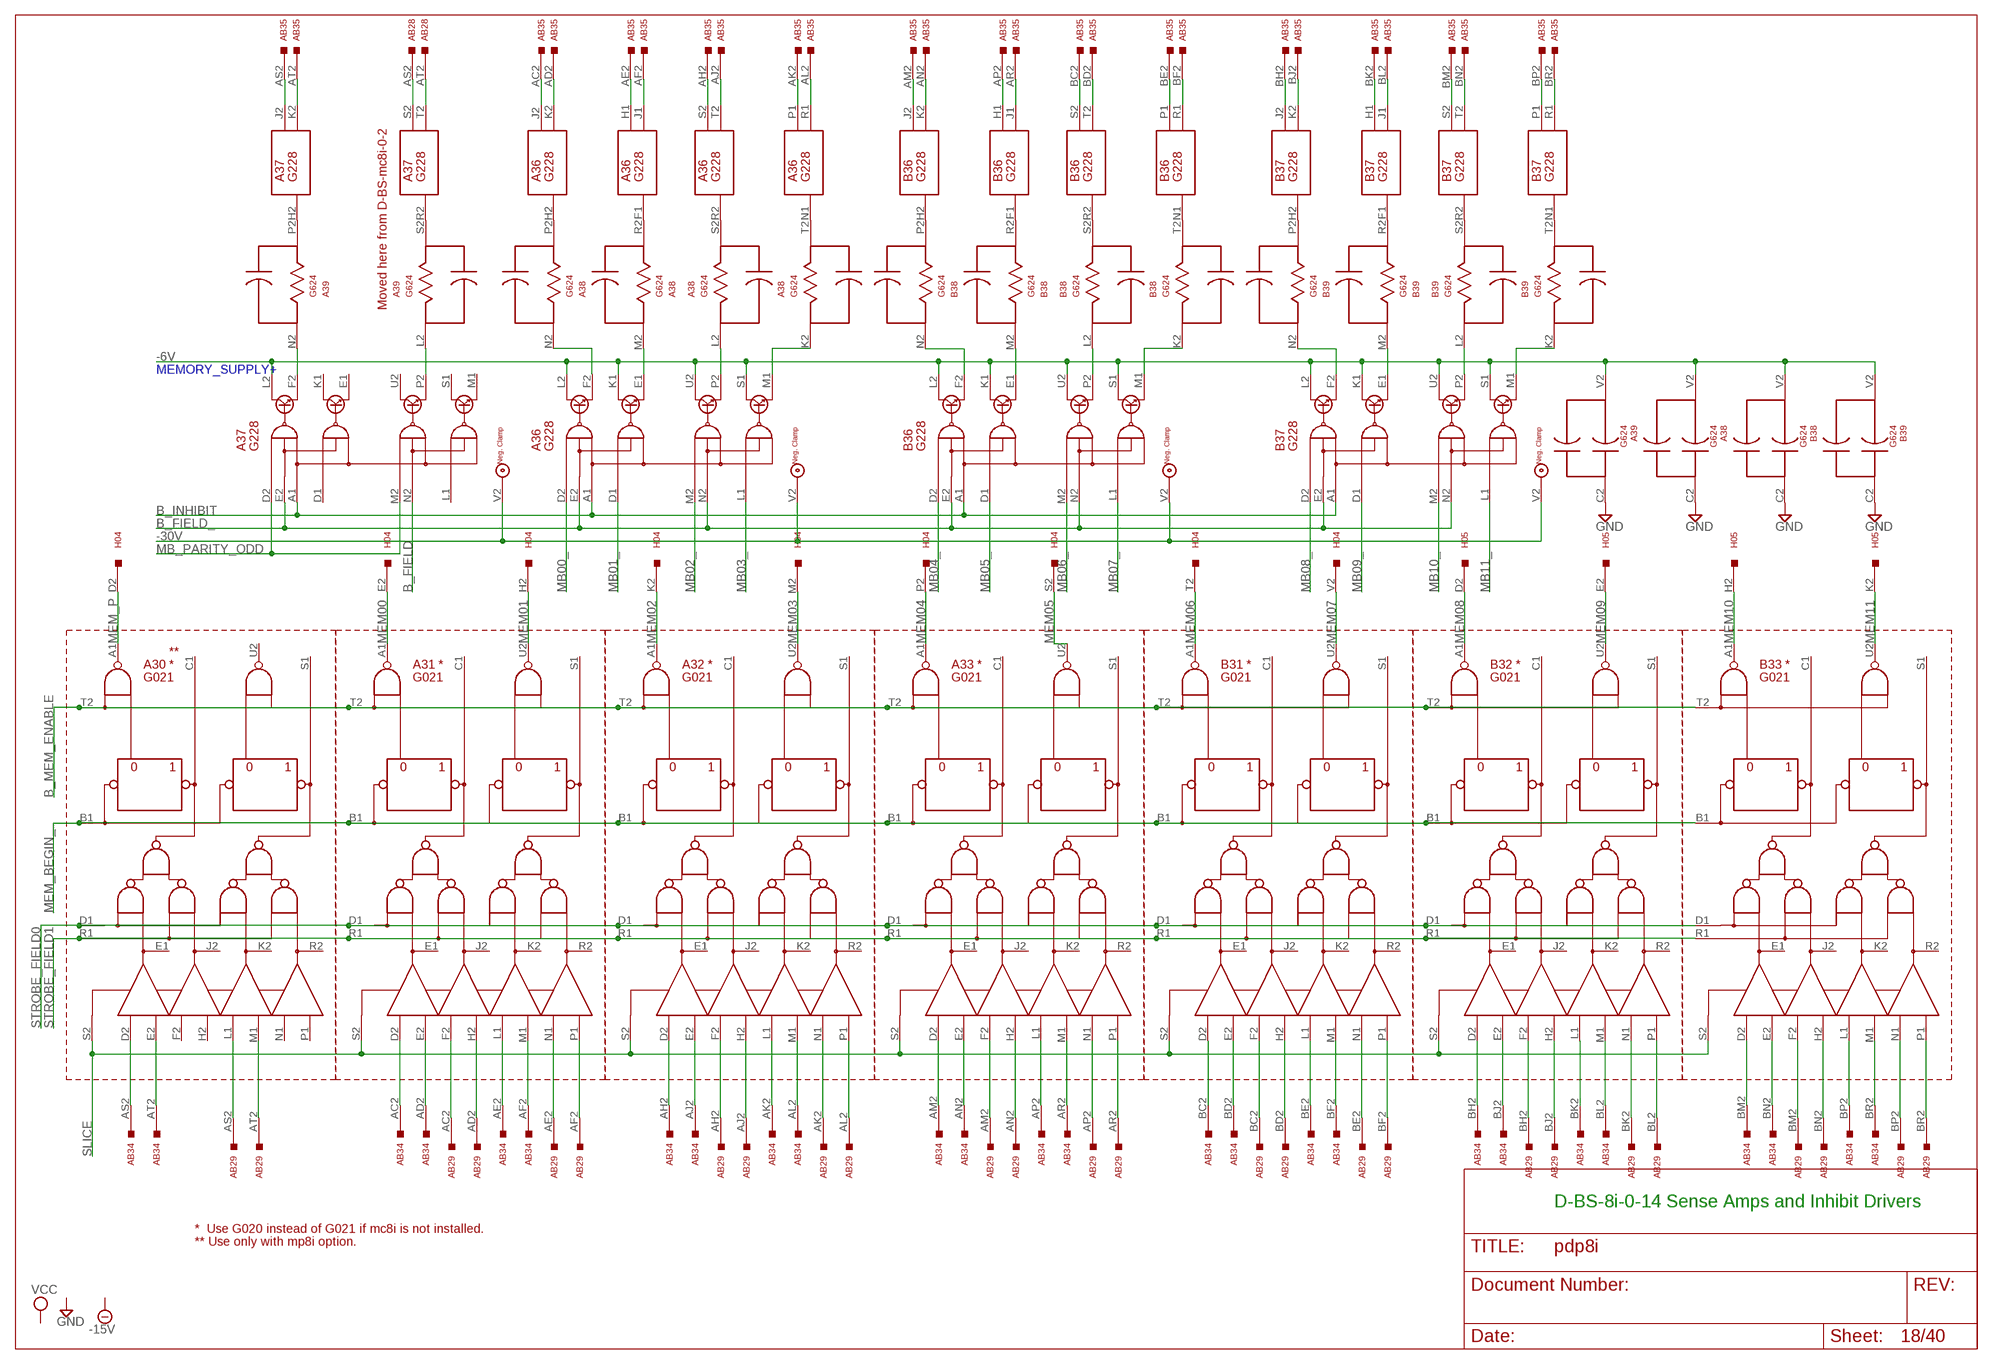
[diagram p18: schematic, sheet 18]

### Parts
A30  G021  [H807]
A31  G021  [H807]
A32  G021  [H807]
A33  G021  [H807]
A36  G228  [H807]
A37  G228  [H807]
AB28  W025  [H807-2]
AB29  W025  [H807-2]
AB34  W025  [H807-2]
B31  G021  [H807]
B32  G021  [H807]
B33  G021  [H807]
B36  G228  [H807]
B37  G228  [H807]
H04  W011  [H807]

### Nets
-6V [Suppply]: A36.K1 A36.L2 A36.S1 A36.U2 A37.L2 A38.V2 A39.V2 B36.K1 B36.L2 B36.S1 B36.U2 B37.K1 B37.L2 B37.S1 B37.U2 B38.V2 B39.V2 ; also sheet 17,23
-30V [Suppply]: A36.V2 A37.V2 B36.V2 B37.V2 ; also sheet 15,17,23,33
B_FIELD: A37.N2 ; also sheet 17,23,24,25
B_FIELD_: A36.E2 A36.N2 A37.E2 B36.E2 B36.N2 B37.E2 B37.N2 ; also sheet 17,19,20
B_INHIBIT: A36.A1 A37.A1 B36.A1 B37.A1 ; also sheet 17,23
B_MEM_ENABLE: A30.T2 A31.T2 A32.T2 A33.T2 B31.T2 B32.T2 B33.T2 ; also sheet 17
GND [Suppply]: A38.C2 A39.C2 B38.C2 B39.C2 ; also sheet 2,5,9,10,11,12,13,14,15,17,23,26,27,30,33,34,35,39
MB00_: A36.D2 ; also sheet 9,23,30
MB01_: A36.D1 ; also sheet 9,23,30
MB02_: A36.M2 ; also sheet 9,23,30
MB03_: A36.L1 ; also sheet 4,5,6,7,8,9,14,15,16,22,23,30,32,33,35,36,37
MB04_: B36.D2 ; also sheet 5,8,9,14,15,16,23,27,29,30,32,33,34,35,36,37
MB05_: B36.D1 ; also sheet 5,8,9,14,15,16,22,23,29,30,33,35,36,38
MB06_: B36.M2 ; also sheet 5,8,9,14,15,22,23,29,30,32,34,35,36,37,38
MB07_: B36.L1 ; also sheet 5,8,9,14,16,22,23,26,28,29,30,32,33,34,36
MB08_: B37.D2 ; also sheet 6,7,8,9,14,16,22,23,26,28,29,30,32,33,34,35
MB09_: B37.D1 ; also sheet 6,9,23,26,27,28,30,33,37
MB10_: B37.M2 ; also sheet 6,8,9,22,23,26,27,28,30,37
MB11_: B37.L1 ; also sheet 2,5,7,8,9,22,23,26,28,29,30
MB_PARITY_ODD: A37.D2 A37.M2 ; also sheet 30
MEM00: A31.A1 H04.E2 ; also sheet 4,10,29,31
MEM01: A31.U2 H04.H2 ; also sheet 4,10,31
MEM02: A32.A1 H04.K2 ; also sheet 4,10,31
MEM03: A32.U2 H04.M2 ; also sheet 11,31
MEM04: A33.A1 H04.P2 ; also sheet 11,31
MEM05: A33.U2 H04.S2 ; also sheet 11,31
MEM06: B31.A1 H04.T2 ; also sheet 12,31
MEM07: B31.U2 H04.V2 ; also sheet 12,31
MEM08: B32.A1 H05.D2 ; also sheet 12,31
MEM09: B32.U2 H05.E2 ; also sheet 13,29,31
MEM10: B33.A1 H05.H2 ; also sheet 13,31
MEM11: B33.U2 H05.K2 ; also sheet 13,31
MEM_BEGIN_: A30.B1 A31.B1 A32.B1 A33.B1 B31.B1 B32.B1 B33.B1 ; also sheet 17
MEM_P: A30.A1 H04.D2 ; also sheet 31
N$299: A36.F2 A38.N2
N$300: A36.H2(H2:H) A38.P2
N$301: A36.F1(F1:H) A38.R2
N$302: A36.E1 A38.M2
N$303: A36.R2(R2:H) A38.S2
N$304: A36.P2 A38.L2
N$305: A36.N1(N1:H) A38.T2
N$306: A36.M1 A38.K2
N$307: A37.H2(H2:H) A39.P2
N$308: A37.F2 A39.N2
N$309: B36.E1 B38.M2
N$310: B36.P2 B38.L2
N$311: B36.M1 B38.K2
N$312: B36.F2 B38.N2
N$313: B36.N1(N1:H) B38.T2
N$314: B36.R2(R2:H) B38.S2
N$315: B36.F1(F1:H) B38.R2
N$316: B36.H2(H2:H) B38.P2
N$317: B37.F2 B39.N2
N$318: B37.E1 B39.M2
N$319: B37.P2 B39.L2
N$320: B37.M1 B39.K2
N$321: B37.H2(H2:H) B39.P2
N$322: B37.N1(N1:H) B39.T2
N$323: B37.R2(R2:H) B39.S2
N$324: B37.F1(F1:H) B39.R2
N$325: A37.J2(H2:J) AB35.AS2
N$326: A37.K2(H2:K) AB35.AT2
N$327: A36.J2(H2:J) AB35.AC2
N$328: A36.K2(H2:K) AB35.AD2
N$329: A36.H1(F1:J) AB35.AE2
N$330: A36.J1(F1:K) AB35.AF2
N$331: A36.S2(R2:J) AB35.AH2
N$332: A36.T2(R2:K) AB35.AJ2
N$333: A36.P1(N1:J) AB35.AK2
N$334: A36.R1(N1:K) AB35.AL2
N$335: AB35.AM2 B36.J2(H2:J)
N$336: AB35.AN2 B36.K2(H2:K)
N$337: AB35.AP2 B36.H1(F1:J)
N$338: AB35.AR2 B36.J1(F1:K)
N$339: AB35.BR2 B37.R1(N1:K)
N$340: AB35.BP2 B37.P1(N1:J)
N$341: AB35.BN2 B37.T2(R2:K)
N$342: AB35.BM2 B37.S2(R2:J)
N$343: AB35.BL2 B37.J1(F1:K)
N$344: AB35.BK2 B37.H1(F1:J)
N$345: AB35.BJ2 B37.K2(H2:K)
N$346: AB35.BH2 B37.J2(H2:J)
N$347: AB35.BF2 B36.R1(N1:K)
N$348: AB35.BE2 B36.P1(N1:J)
N$349: AB35.BC2 B36.S2(R2:J)
N$350: AB35.BD2 B36.T2(R2:K)
N$351: A30.D2 AB34.AS2
N$352: A30.E2 AB34.AT2
N$353: A31.D2 AB34.AC2
N$354: A31.E2 AB34.AD2
N$355: A31.L1 AB34.AE2
N$356: A31.M1 AB34.AF2
N$357: A32.D2 AB34.AH2
N$358: A32.E2 AB34.AJ2
N$359: A32.L1 AB34.AK2
N$360: A32.M1 AB34.AL2
N$361: A33.D2 AB34.AM2
N$362: A33.E2 AB34.AN2
N$363: A33.L1 AB34.AP2
N$364: A33.M1 AB34.AR2
N$365: A30.L1 AB29.AS2
N$366: A30.M1 AB29.AT2
N$367: A31.F2 AB29.AC2
N$368: A31.H2 AB29.AD2
N$369: A31.N1 AB29.AE2
N$370: A31.P1 AB29.AF2
N$371: A32.F2 AB29.AH2
N$372: A32.H2 AB29.AJ2
N$373: A32.N1 AB29.AK2
N$374: A32.P1 AB29.AL2
N$375: A33.F2 AB29.AM2
N$376: A33.H2 AB29.AN2
N$377: A33.N1 AB29.AP2
N$378: A33.P1 AB29.AR2
N$379: AB34.BP2 B33.L1
N$380: AB34.BR2 B33.M1
N$381: AB34.BM2 B33.D2
N$382: AB34.BN2 B33.E2
N$383: AB34.BK2 B32.L1
N$384: AB34.BL2 B32.M1
N$385: AB34.BJ2 B32.E2
N$386: AB34.BH2 B32.D2
N$387: AB34.BC2 B31.D2
N$388: AB34.BD2 B31.E2
N$389: AB34.BE2 B31.L1
N$390: AB34.BF2 B31.M1
N$391: AB29.BC2 B31.F2
N$392: AB29.BD2 B31.H2
N$393: AB29.BE2 B31.N1
N$394: AB29.BF2 B31.P1
N$395: AB29.BH2 B32.F2
N$396: AB29.BJ2 B32.H2
N$397: AB29.BK2 B32.N1
N$398: AB29.BL2 B32.P1
N$399: AB29.BM2 B33.F2
N$400: AB29.BN2 B33.H2
N$401: AB29.BP2 B33.N1
N$402: AB29.BR2 B33.P1
N$544: A37.P2 A39.L2
N$545: A37.R2(R2:H) A39.S2
N$546: A37.S2(R2:J) AB28.AS2
N$547: A37.T2(R2:K) AB28.AT2
SLICE: A30.S2 A31.S2 A32.S2 A33.S2 B31.S2 B32.S2 B33.S2
STROBE_FIELD0: A30.D1 A31.D1 A32.D1 A33.D1 B31.D1 B32.D1 B33.D1 ; also sheet 17
STROBE_FIELD1: A30.R1 A31.R1 A32.R1 A33.R1 B31.R1 B32.R1 B33.R1 ; also sheet 17
Unconnected: A30.C1 A30.E1 A30.F2 A30.H2 A30.J2 A30.K2 A30.N1 A30.P1 A30.R2 A30.S1 A30.U2 A31.C1 A31.E1 A31.J2 A31.K2 A31.R2 A31.S1 A32.C1 A32.E1 A32.J2 A32.K2 A32.R2 A32.S1 A33.C1 A33.E1 A33.J2 A33.K2 A33.R2 A33.S1 A37.D1 A37.E1 A37.F1(F1:H) A37.H1(F1:J) A37.J1(F1:K) A37.K1 A37.L1 A37.M1 A37.N1(N1:H) A37.P1(N1:J) A37.R1(N1:K) A37.S1 A37.U2 AB28.AA2 AB28.AB2 AB28.AU2 AB28.AV2 AB28.BA2 AB28.BB2 AB28.BS2 AB28.BT2 AB28.BU2 AB28.BV2 AB29.AA2 AB29.AB2 AB29.AU2 AB29.AV2 AB29.BA2 AB29.BB2 AB29.BS2 AB29.BT2 AB29.BU2 AB29.BV2 AB34.AA2 AB34.AB2 AB34.AU2 AB34.AV2 AB34.BA2 AB34.BB2 AB34.BS2 AB34.BT2 AB34.BU2 AB34.BV2 B31.C1 B31.E1 B31.J2 B31.K2 B31.R2 B31.S1 B32.C1 B32.E1 B32.J2 B32.K2 B32.R2 B32.S1 B33.C1 B33.E1 B33.J2 B33.K2 B33.R2 B33.S1

### Notes on the sheet
- Moved here from D-BS-mc8i-0-2
- MEMORY_SUPPLY+
- **
- * | * | * | * | * | * | *
- D-BS-8i-0-14 Sense Amps and Inhibit Drivers
- *  Use G020 instead of G021 if mc8i is not installed.
- ** Use only with mp8i option.

## Sheet 19 of 40
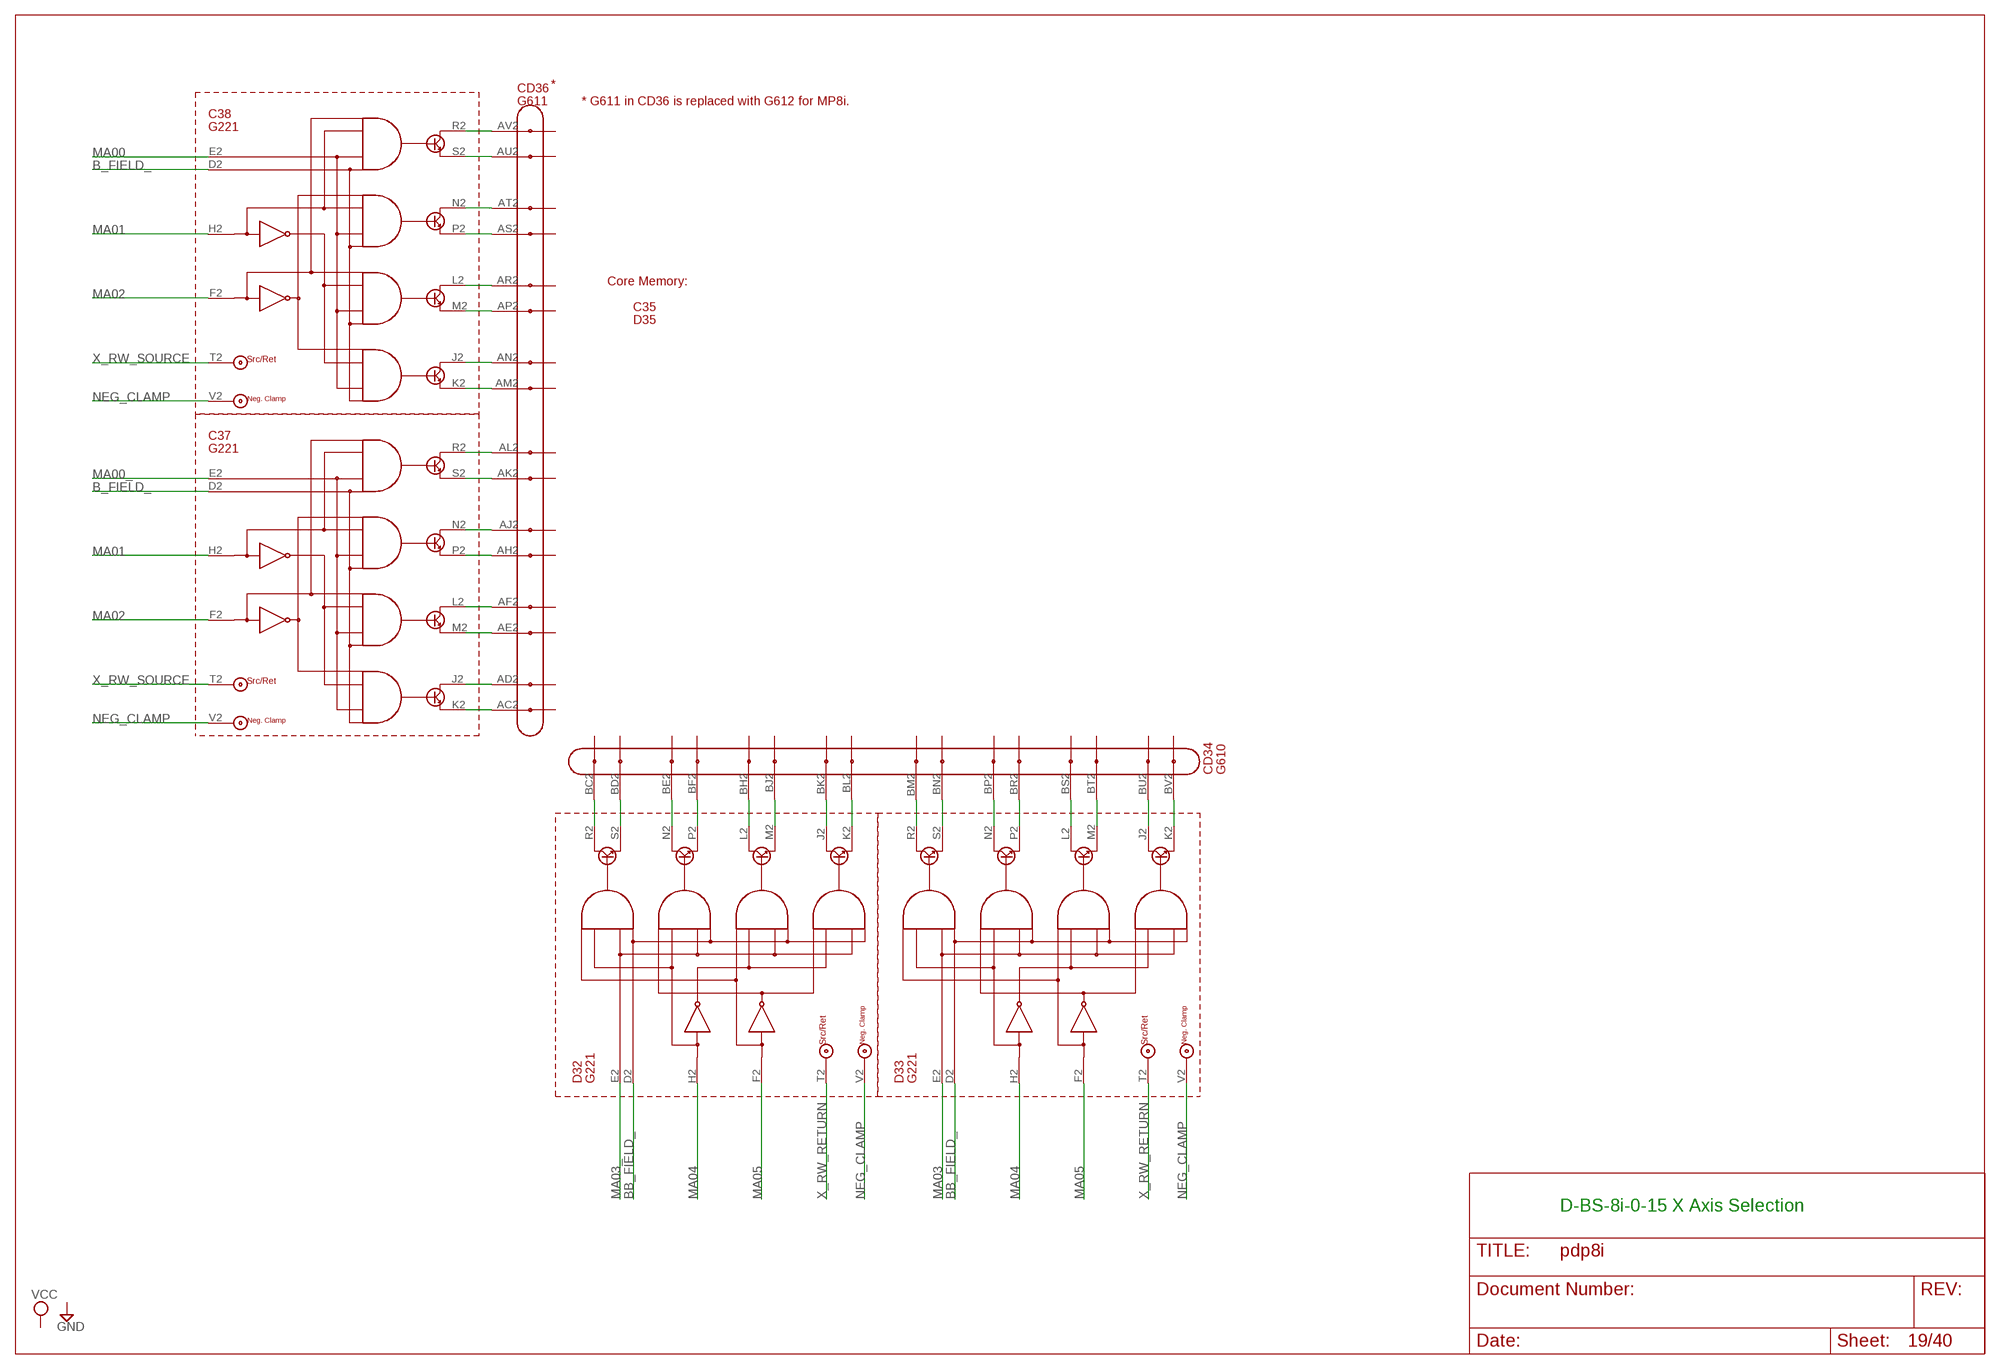
[diagram p19: schematic, sheet 19]

### Parts
C35  H807  [H807]
C37  G221  [H807]
C38  G221  [H807]
CD34  G610  [H807-2]
CD36  G611  G610  [H807-2]
D32  G221  [H807]
D33  G221  [H807]
D35  H807  [H807]

### Nets
B_FIELD_: C37.D2 C38.D2 ; also sheet 17,18,20
BB_FIELD_: D32.D2 D33.D2 ; also sheet 17,20
C23J2: C38.J2 CD36.AN2(N2)
C23K2: C38.K2 CD36.AM2(M2)
C23L2: C38.L2 CD36.AR2(R2)
C23M2: C38.M2 CD36.AP2(P2)
C23N2: C38.N2 CD36.AT2(T2)
C23P2: C38.P2 CD36.AS2(S2)
C23R2: C38.R2 CD36.AV2(V2)
C23S2: C38.S2 CD36.AU2(U2)
C24J2: C37.J2 CD36.AD2(D2)
C24K2: C37.K2 CD36.AC2(C2)
C24M2: C37.M2 CD36.AE2(E2)
C24N2: C37.N2 CD36.AJ2(J2)
C24P2: C37.P2 CD36.AH2(H2)
C24R2: C37.R2 CD36.AL2(L2)
C24S2: C37.S2 CD36.AK2(K2)
D18J2: CD34.BK2(K2) D32.J2
D18K2: CD34.BL2(L2) D32.K2
D18L2: CD34.BH2(H2) D32.L2
D18M2: CD34.BJ2(J2) D32.M2
D18N2: CD34.BE2(E2) D32.N2
D18P2: CD34.BF2(F2) D32.P2
D18R2: CD34.BC2(C2) D32.R2
D18S2: CD34.BD2(D2) D32.S2
D19J2: CD34.BU2(U2) D33.J2
D19K2: CD34.BV2(V2) D33.K2
D19L2: CD34.BS2(S2) D33.L2
D19M2: CD34.BT2(T2) D33.M2
D19N2: CD34.BP2(P2) D33.N2
D19P2: CD34.BR2(R2) D33.P2
D19R2: CD34.BM2(M2) D33.R2
D19S2: CD34.BN2(N2) D33.S2
MA00: C38.E2 ; also sheet 9,24
MA00_: C37.E2 ; also sheet 6,9,21,24
MA01: C37.H2 C38.H2 ; also sheet 9,24
MA02: C37.F2 C38.F2 ; also sheet 9,24
MA03: D33.E2 ; also sheet 9,24
MA03_: D32.E2 ; also sheet 6,9,21,24
MA04: D32.H2 D33.H2 ; also sheet 9,24
MA05: D32.F2 D33.F2 ; also sheet 9,24
NEG_CLAMP: C37.V2 C38.V2 D32.V2 D33.V2 ; also sheet 17,20,24,25
V24L2: C37.L2 CD36.AF2(F2)
X_RW_RETURN: D32.T2 D33.T2 ; also sheet 17,24
X_RW_SOURCE: C37.T2 C38.T2 ; also sheet 17,24

### Notes on the sheet
- *
- * G611 in CD36 is replaced with G612 for MP8i.
- Core Memory:
- D-BS-8i-0-15 X Axis Selection

## Sheet 20 of 40
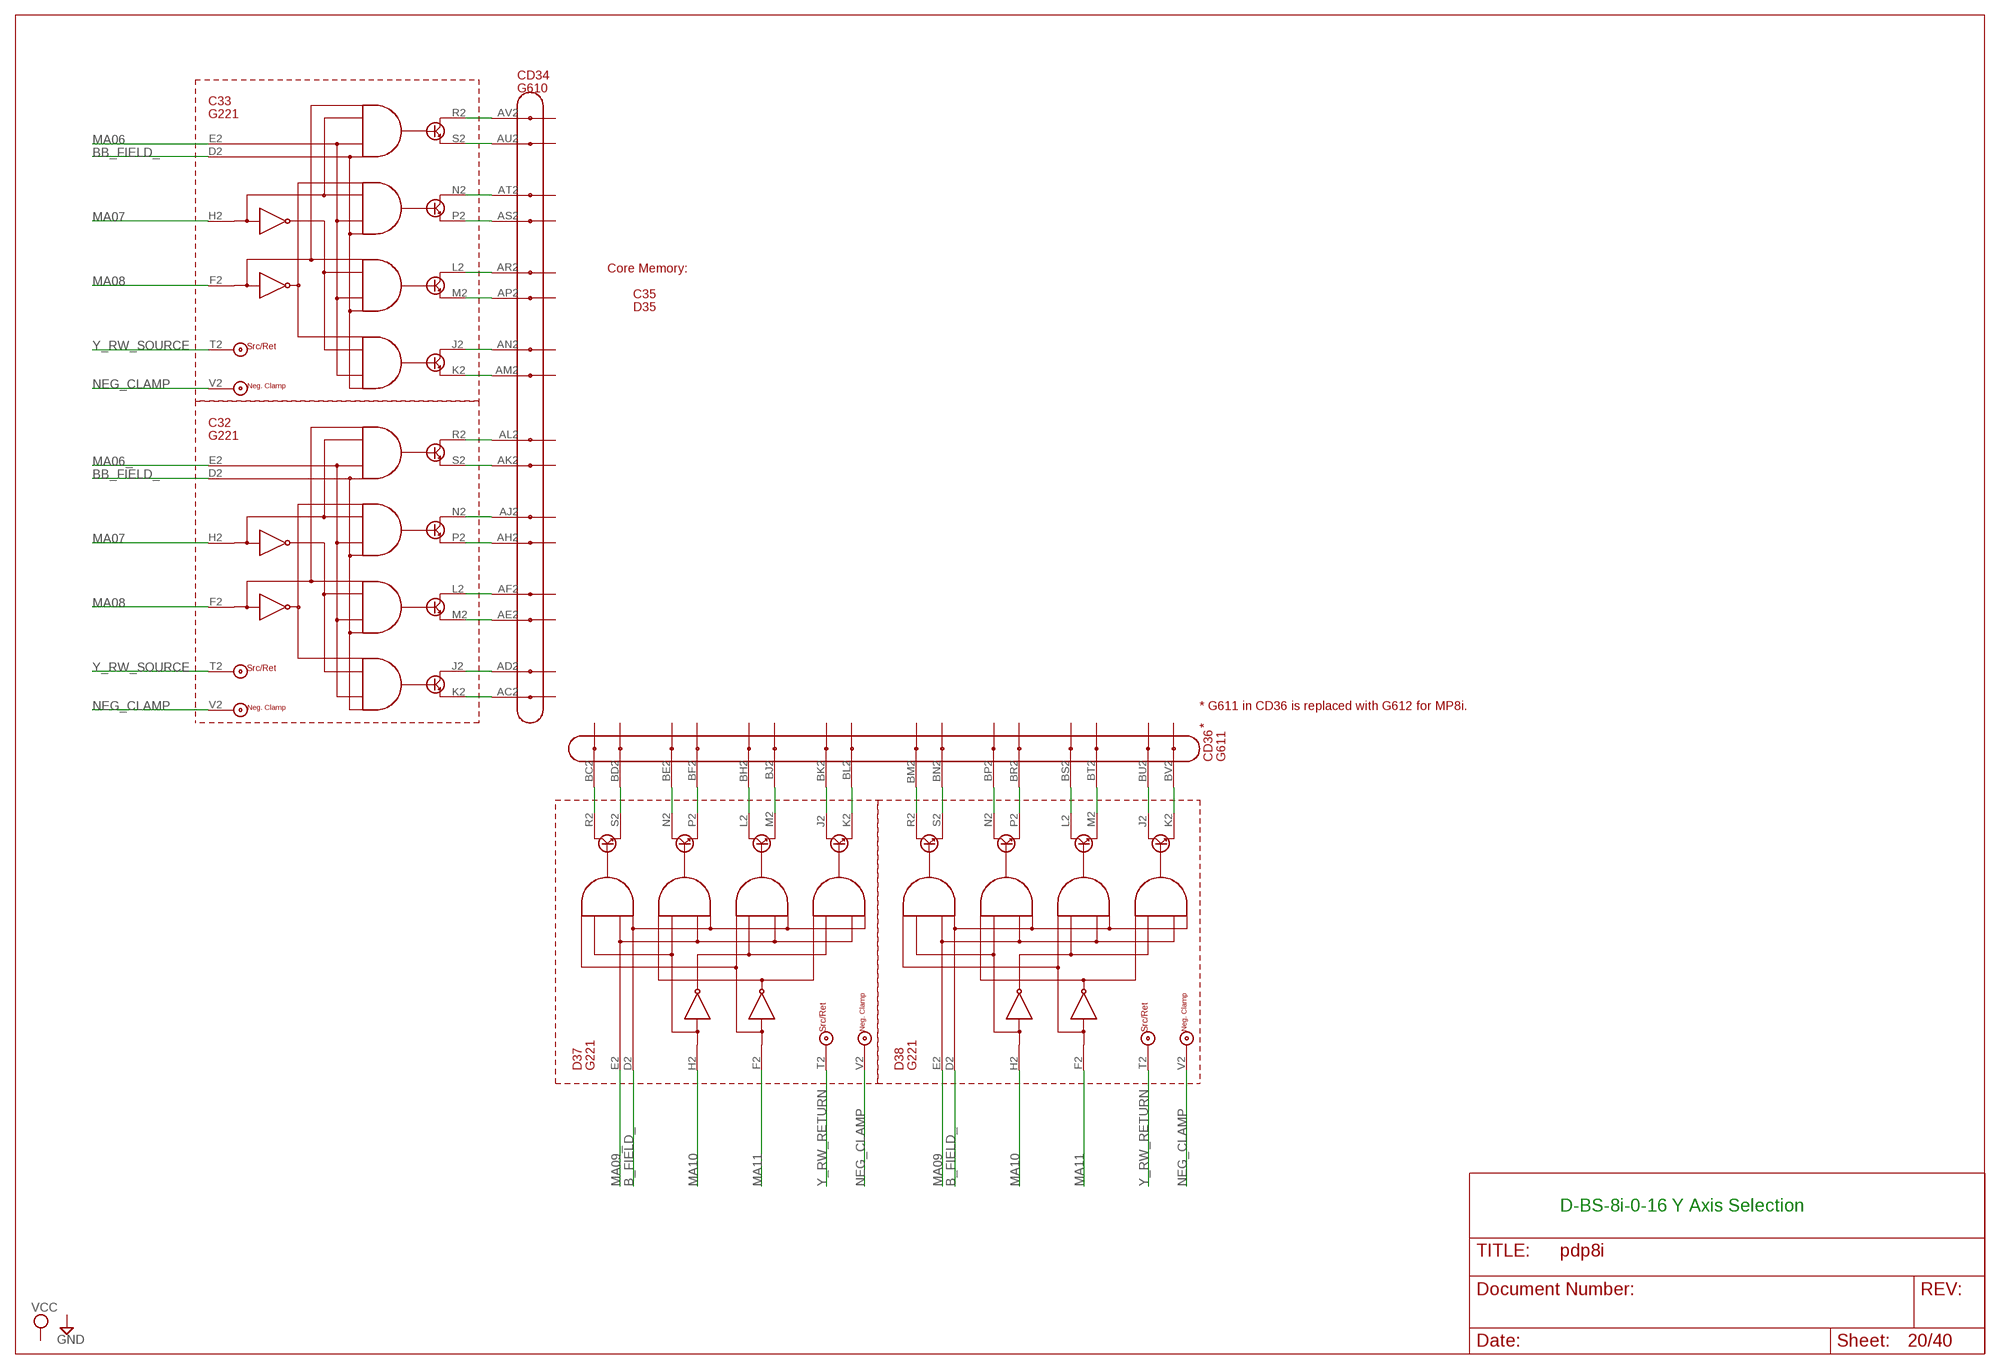
[diagram p20: schematic, sheet 20]

### Parts
C32  G221  [H807]
C33  G221  [H807]
D37  G221  [H807]
D38  G221  [H807]

### Nets
B_FIELD_: D37.D2 D38.D2 ; also sheet 17,18,19
BB_FIELD_: C32.D2 C33.D2 ; also sheet 17,19
C23J1: C33.J2 CD34.AN2(N2)
C23K1: C33.K2 CD34.AM2(M2)
C23L1: C33.L2 CD34.AR2(R2)
C23M1: C33.M2 CD34.AP2(P2)
C23N1: C33.N2 CD34.AT2(T2)
C23P1: C33.P2 CD34.AS2(S2)
C23R1: C33.R2 CD34.AV2(V2)
C23S1: C33.S2 CD34.AU2(U2)
C24J1: C32.J2 CD34.AD2(D2)
C24K1: C32.K2 CD34.AC2(C2)
C24M1: C32.M2 CD34.AE2(E2)
C24N1: C32.N2 CD34.AJ2(J2)
C24P1: C32.P2 CD34.AH2(H2)
C24R1: C32.R2 CD34.AL2(L2)
C24S1: C32.S2 CD34.AK2(K2)
D18J1: CD36.BK2(K2) D37.J2
D18K1: CD36.BL2(L2) D37.K2
D18L1: CD36.BH2(H2) D37.L2
D18M1: CD36.BJ2(J2) D37.M2
D18N1: CD36.BE2(E2) D37.N2
D18P1: CD36.BF2(F2) D37.P2
D18R1: CD36.BC2(C2) D37.R2
D18S1: CD36.BD2(D2) D37.S2
D19J1: CD36.BU2(U2) D38.J2
D19K1: CD36.BV2(V2) D38.K2
D19L1: CD36.BS2(S2) D38.L2
D19M1: CD36.BT2(T2) D38.M2
D19N1: CD36.BP2(P2) D38.N2
D19P1: CD36.BR2(R2) D38.P2
D19R1: CD36.BM2(M2) D38.R2
D19S1: CD36.BN2(N2) D38.S2
MA06: C33.E2 ; also sheet 9,25
MA06_: C32.E2 ; also sheet 6,9,21,25
MA07: C32.H2 C33.H2 ; also sheet 9,25
MA08: C32.F2 C33.F2 ; also sheet 6,9,25
MA09: D38.E2 ; also sheet 9,25
MA09_: D37.E2 ; also sheet 9,21,25
MA10: D37.H2 D38.H2 ; also sheet 9,25
MA11: D37.F2 D38.F2 ; also sheet 9,25
NEG_CLAMP: C32.V2 C33.V2 D37.V2 D38.V2 ; also sheet 17,19,24,25
V24L1: C32.L2 CD34.AF2(F2)
Y_RW_RETURN: D37.T2 D38.T2 ; also sheet 17,25
Y_RW_SOURCE: C32.T2 C33.T2 ; also sheet 17,25

### Notes on the sheet
- Core Memory:
- C35
- D35
- * G611 in CD36 is replaced with G612 for MP8i.
- *
- D-BS-8i-0-16 Y Axis Selection